# Altium project MT7688.PrjPcb (part 1 of 2)
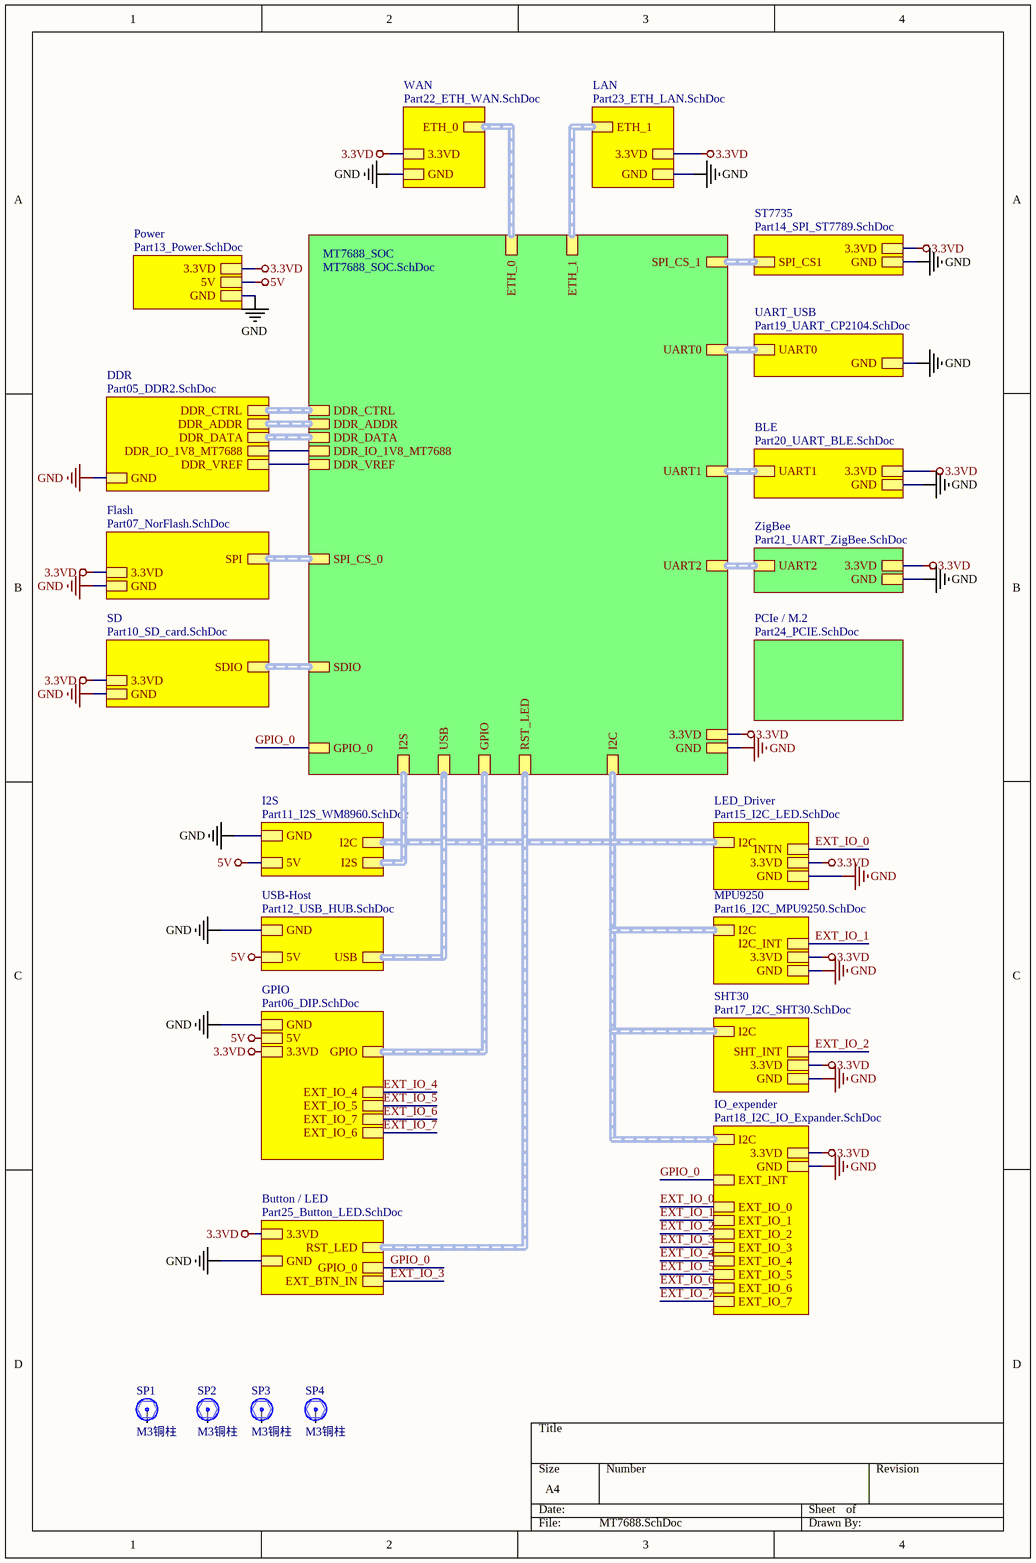
[diagram p0: MT7688.SchDoc]
26 sheets, 361 parts. Net scope: strictly hierarchical (ports join the sheet entries above them; power ports are local).
Board file: MT7688.PcbDoc
Sheets:
  MT7688.SchDoc
    MT7688_SOC = MT7688_SOC.SchDoc
      Designator = Part03_MT7688_Peripheral.SchDoc
      Designator = Part04_MT7688_Power.SchDoc
      Designator = Part01_MT7688_RF.SchDoc
      Designator = Part09_Config.SchDoc
      Designator = Part02_MT7688_DDR.SchDoc
    Power = Part13_Power.SchDoc
    DDR = Part05_DDR2.SchDoc
    WAN = Part22_ETH_WAN.SchDoc
    Flash = Part07_NorFlash.SchDoc
    Button / LED = Part25_Button_LED.SchDoc
    LAN = Part23_ETH_LAN.SchDoc
    GPIO = Part06_DIP.SchDoc
    I2S = Part11_I2S_WM8960.SchDoc
    ST7735 = Part14_SPI_ST7789.SchDoc
    BLE = Part20_UART_BLE.SchDoc
    SD = Part10_SD_card.SchDoc
    USB-Host = Part12_USB_HUB.SchDoc
    PCIe / M.2 = Part24_PCIE.SchDoc
    ZigBee = Part21_UART_ZigBee.SchDoc
    IO_expender = Part18_I2C_IO_Expander.SchDoc
    LED_Driver = Part15_I2C_LED.SchDoc
    MPU9250 = Part16_I2C_MPU9250.SchDoc
    SHT30 = Part17_I2C_SHT30.SchDoc
    UART_USB = Part19_UART_CP2104.SchDoc

## Sheet MT7688.SchDoc
size A4 portrait

### Parts
SP1  M3铜柱  [M3x5_N]
SP2  M3铜柱  [M3x5_N]
SP3  M3铜柱  [M3x5_N]
SP4  M3铜柱  [M3x5_N]

### Sub-sheets
BLE = Part20_UART_BLE.SchDoc: 3.3VD, UART1 (harness UART1), GND
Button / LED = Part25_Button_LED.SchDoc: GND, 3.3VD, RST_LED (harness RST), GPIO_0, EXT_BTN_IN
DDR = Part05_DDR2.SchDoc: DDR_CTRL (harness DDR_CTRL), DDR_ADDR (harness DDR_ADDR), DDR_DATA (harness DDR_DATA), DDR_IO_1V8_MT7688, DDR_VREF, GND
Flash = Part07_NorFlash.SchDoc: GND, SPI (harness SPI_CS_0), 3.3VD
GPIO = Part06_DIP.SchDoc: GPIO (harness GPIO), GND, 5V, 3.3VD, EXT_IO_4, EXT_IO_5, EXT_IO_7, EXT_IO_6
I2S = Part11_I2S_WM8960.SchDoc: 5V, I2S (harness I2S), GND, I2C (harness I2C)
IO_expender = Part18_I2C_IO_Expander.SchDoc: GND, 3.3VD, I2C (harness I2C), EXT_INT, EXT_IO_3, EXT_IO_6, EXT_IO_7, EXT_IO_5, EXT_IO_2, EXT_IO_0, EXT_IO_1, EXT_IO_4
LAN = Part23_ETH_LAN.SchDoc: GND, ETH_1 (harness ETH_1), 3.3VD
LED_Driver = Part15_I2C_LED.SchDoc: GND, I2C (harness I2C), 3.3VD, INTN
MPU9250 = Part16_I2C_MPU9250.SchDoc: I2C (harness I2C), 3.3VD, GND, I2C_INT
MT7688_SOC = MT7688_SOC.SchDoc: I2S, GPIO, UART0, DDR_IO_1V8_MT7688, GND, ETH_1, I2C, SPI_CS_1, SDIO, USB, DDR_CTRL, UART2, UART1, SPI_CS_0, ETH_0, DDR_DATA, DDR_ADDR, DDR_VREF, 3.3VD, GPIO_0, RST_LED
PCIe / M.2 = Part24_PCIE.SchDoc: no entries
Power = Part13_Power.SchDoc: GND, 3.3VD, 5V
SD = Part10_SD_card.SchDoc: 3.3VD, GND, SDIO (harness SDIO)
SHT30 = Part17_I2C_SHT30.SchDoc: 3.3VD, GND, I2C (harness I2C), SHT_INT
ST7735 = Part14_SPI_ST7789.SchDoc: 3.3VD, SPI_CS1 (harness SPI_CS_1), GND
UART_USB = Part19_UART_CP2104.SchDoc: UART0 (harness UART0), GND
USB-Host = Part12_USB_HUB.SchDoc: GND, 5V, USB (harness USB)
WAN = Part22_ETH_WAN.SchDoc: 3.3VD, GND, ETH_0 (harness ETH_0)
ZigBee = Part21_UART_ZigBee.SchDoc: UART2 (harness UART2), GND, 3.3VD

### Nets
3.3VD: sheet MT7688_SOC/3.3VD, sheet Power/3.3VD, sheet WAN/3.3VD, sheet Flash/3.3VD, sheet Button / LED/3.3VD, sheet LAN/3.3VD, sheet GPIO/3.3VD, sheet ST7735/3.3VD, sheet BLE/3.3VD, sheet SD/3.3VD, sheet ZigBee/3.3VD, sheet IO_expender/3.3VD, sheet LED_Driver/3.3VD, sheet MPU9250/3.3VD, sheet SHT30/3.3VD
5V: sheet Power/5V, sheet GPIO/5V, sheet I2S/5V, sheet USB-Host/5V
DDR_1V8: sheet MT7688_SOC/DDR_IO_1V8_MT7688, sheet DDR/DDR_IO_1V8_MT7688
DDR_VREF: sheet MT7688_SOC/DDR_VREF, sheet DDR/DDR_VREF
GND: sheet MT7688_SOC/GND, sheet Power/GND, sheet DDR/GND, sheet WAN/GND, sheet Flash/GND, sheet Button / LED/GND, sheet LAN/GND, sheet GPIO/GND, sheet I2S/GND, sheet ST7735/GND, sheet BLE/GND, sheet SD/GND, sheet USB-Host/GND, sheet ZigBee/GND, sheet IO_expender/GND, sheet LED_Driver/GND, sheet MPU9250/GND, sheet SHT30/GND, sheet UART_USB/GND
EXT_IO_0: sheet IO_expender/EXT_IO_0, sheet LED_Driver/INTN
EXT_IO_1: sheet IO_expender/EXT_IO_1, sheet MPU9250/I2C_INT
EXT_IO_2: sheet IO_expender/EXT_IO_2, sheet SHT30/SHT_INT
EXT_IO_3: sheet Button / LED/EXT_BTN_IN, sheet IO_expender/EXT_IO_3  [project net EXT_BTN_IN]
EXT_IO_4: sheet GPIO/EXT_IO_4, sheet IO_expender/EXT_IO_4  [project net EXT__4]
EXT_IO_5: sheet GPIO/EXT_IO_5, sheet IO_expender/EXT_IO_5  [project net EXT__5]
EXT_IO_6: sheet GPIO/EXT_IO_7, sheet IO_expender/EXT_IO_6  [project net EXT__7]
EXT_IO_7: sheet GPIO/EXT_IO_6, sheet IO_expender/EXT_IO_7  [project net EXT__6]
GPIO_0: sheet MT7688_SOC/GPIO_0, sheet Button / LED/GPIO_0, sheet IO_expender/EXT_INT  [project net EXT_INT]

Not connected (* = marked no-connect by the designer): SP1 1; SP2 1; SP3 1; SP4 1

### Buses and harness runs
harness sheet BLE/UART1 = sheet MT7688_SOC/UART1
harness sheet Button / LED/RST_LED = sheet MT7688_SOC/RST_LED
harness sheet DDR/DDR_ADDR = sheet MT7688_SOC/DDR_ADDR
harness sheet DDR/DDR_CTRL = sheet MT7688_SOC/DDR_CTRL
harness sheet DDR/DDR_DATA = sheet MT7688_SOC/DDR_DATA
harness sheet Flash/SPI = sheet MT7688_SOC/SPI_CS_0
harness sheet GPIO/GPIO = sheet MT7688_SOC/GPIO
harness sheet I2S/I2C = sheet IO_expender/I2C = sheet LED_Driver/I2C = sheet MPU9250/I2C = sheet MT7688_SOC/I2C = sheet SHT30/I2C
harness sheet I2S/I2S = sheet MT7688_SOC/I2S
harness sheet LAN/ETH_1 = sheet MT7688_SOC/ETH_1
harness sheet MT7688_SOC/ETH_0 = sheet WAN/ETH_0
harness sheet MT7688_SOC/SDIO = sheet SD/SDIO
harness sheet MT7688_SOC/SPI_CS_1 = sheet ST7735/SPI_CS1
harness sheet MT7688_SOC/UART0 = sheet UART_USB/UART0
harness sheet MT7688_SOC/UART2 = sheet ZigBee/UART2
harness sheet MT7688_SOC/USB = sheet USB-Host/USB

### Library data of the parts
SP1-SP4 = 铜柱大焊盘: 铜柱; 版权归属: 源创客; BOM名称: 铜柱; 学习资源: www.ooocke.com

## Sheet MT7688_SOC.SchDoc
size A4
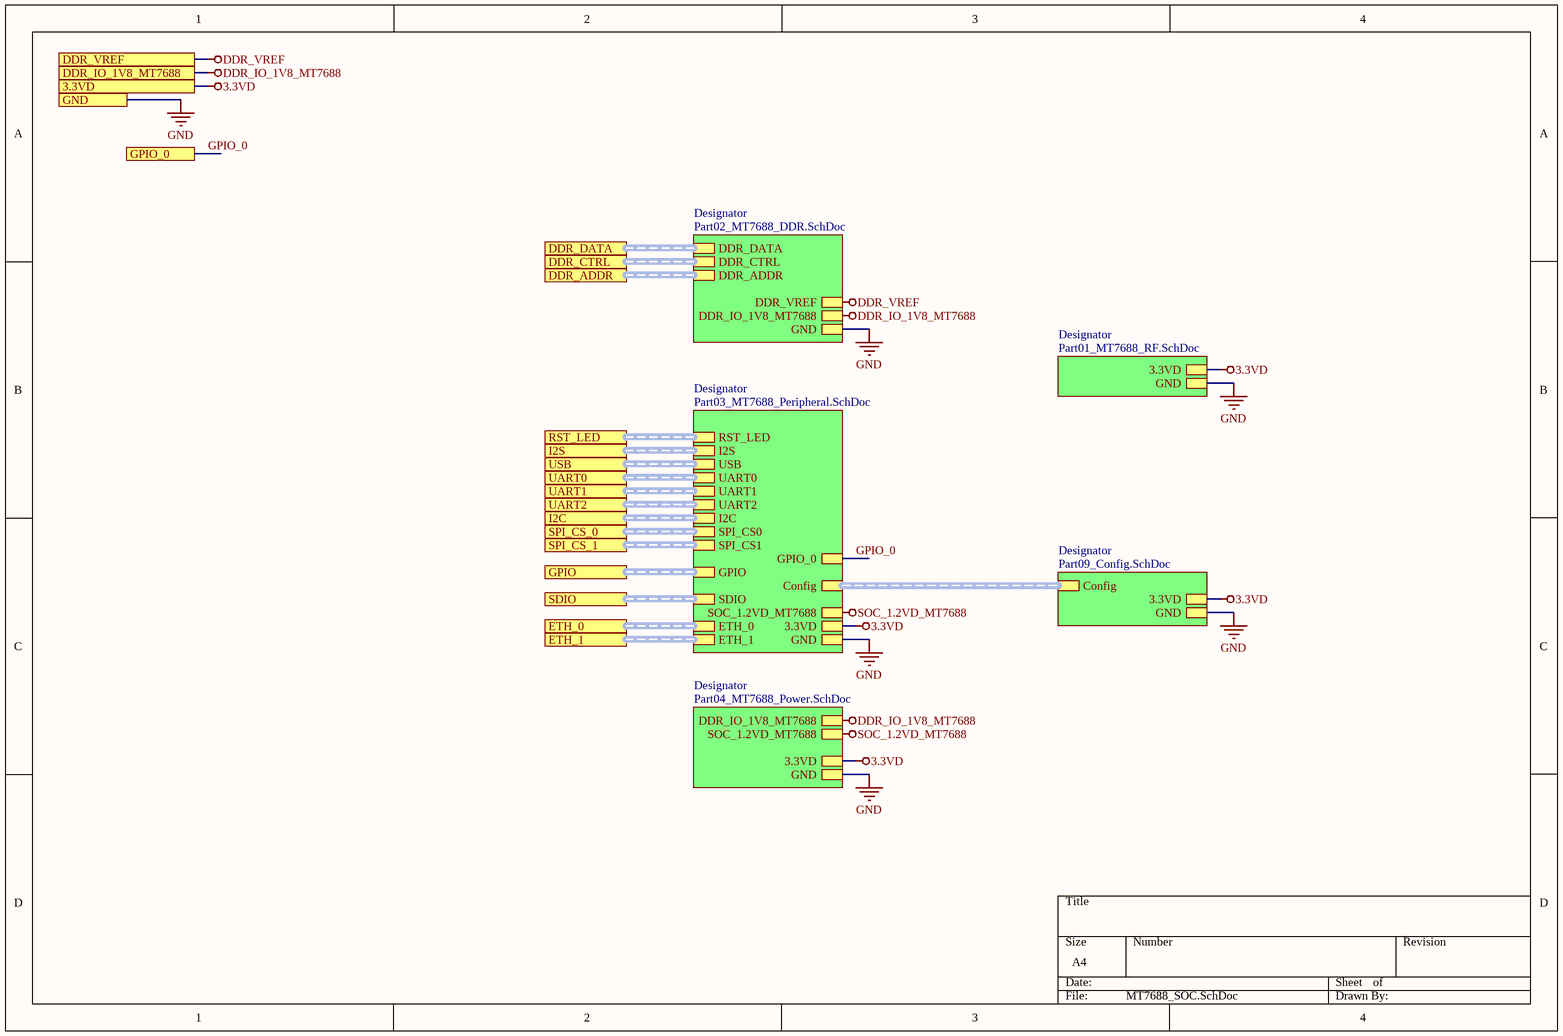
[diagram p1: MT7688_SOC.SchDoc]

### Sub-sheets
Designator = Part03_MT7688_Peripheral.SchDoc: I2S (harness I2S), USB (harness USB), UART1 (harness UART1), ETH_1 (harness ETH_1), UART0 (harness UART0), I2C (harness I2C), GPIO (harness GPIO), ETH_0 (harness ETH_0), UART2 (harness UART2), SDIO (harness SDIO), Config (harness Config), RST_LED (harness RST), SPI_CS0 (harness SPI_CS_0), SPI_CS1 (harness SPI_CS_1), 3.3VD, GND, SOC_1.2VD_MT7688, GPIO_0
Designator = Part04_MT7688_Power.SchDoc: GND, DDR_IO_1V8_MT7688, 3.3VD, SOC_1.2VD_MT7688
Designator = Part01_MT7688_RF.SchDoc: GND, 3.3VD
Designator = Part09_Config.SchDoc: GND, 3.3VD, Config (harness Config)
Designator = Part02_MT7688_DDR.SchDoc: DDR_DATA (harness DDR_DATA), DDR_CTRL (harness DDR_CTRL), DDR_ADDR (harness DDR_ADDR), DDR_VREF, DDR_IO_1V8_MT7688, GND

### Ports
3.3VD, DDR_ADDR, DDR_CTRL, DDR_DATA, DDR_IO_1V8_MT7688, DDR_VREF, ETH_0, ETH_1, GND, GPIO, GPIO_0, I2C, I2S, RST_LED, SDIO, SPI_CS_0, SPI_CS_1, UART0, UART1, UART2, USB

### Nets
3.3VD: port 3.3VD, sheet Designator/3.3VD, sheet Designator/3.3VD, sheet Designator/3.3VD, sheet Designator/3.3VD
DDR_IO_1V8_MT7688: port DDR_IO_1V8_MT7688, sheet Designator/DDR_IO_1V8_MT7688, sheet Designator/DDR_IO_1V8_MT7688  [project net DDR_1V8]
DDR_VREF: port DDR_VREF, sheet Designator/DDR_VREF
GND: port GND, sheet Designator/GND, sheet Designator/GND, sheet Designator/GND, sheet Designator/GND, sheet Designator/GND
SOC_1.2VD_MT7688: sheet Designator/SOC_1.2VD_MT7688, sheet Designator/SOC_1.2VD_MT7688
GPIO_0: port GPIO_0, sheet Designator/GPIO_0  [project net EXT_INT]

### Buses and harness runs
harness port DDR_ADDR = sheet Designator/DDR_ADDR
harness port DDR_CTRL = sheet Designator/DDR_CTRL
harness port DDR_DATA = sheet Designator/DDR_DATA
harness port ETH_0 = sheet Designator/ETH_0
harness port ETH_1 = sheet Designator/ETH_1
harness port GPIO = sheet Designator/GPIO
harness port I2C = sheet Designator/I2C
harness port I2S = sheet Designator/I2S
harness port RST_LED = sheet Designator/RST_LED
harness port SDIO = sheet Designator/SDIO
harness port SPI_CS_0 = sheet Designator/SPI_CS0
harness port SPI_CS_1 = sheet Designator/SPI_CS1
harness port UART0 = sheet Designator/UART0
harness port UART1 = sheet Designator/UART1
harness port UART2 = sheet Designator/UART2
harness port USB = sheet Designator/USB

## Sheet Part03_MT7688_Peripheral.SchDoc
size A4
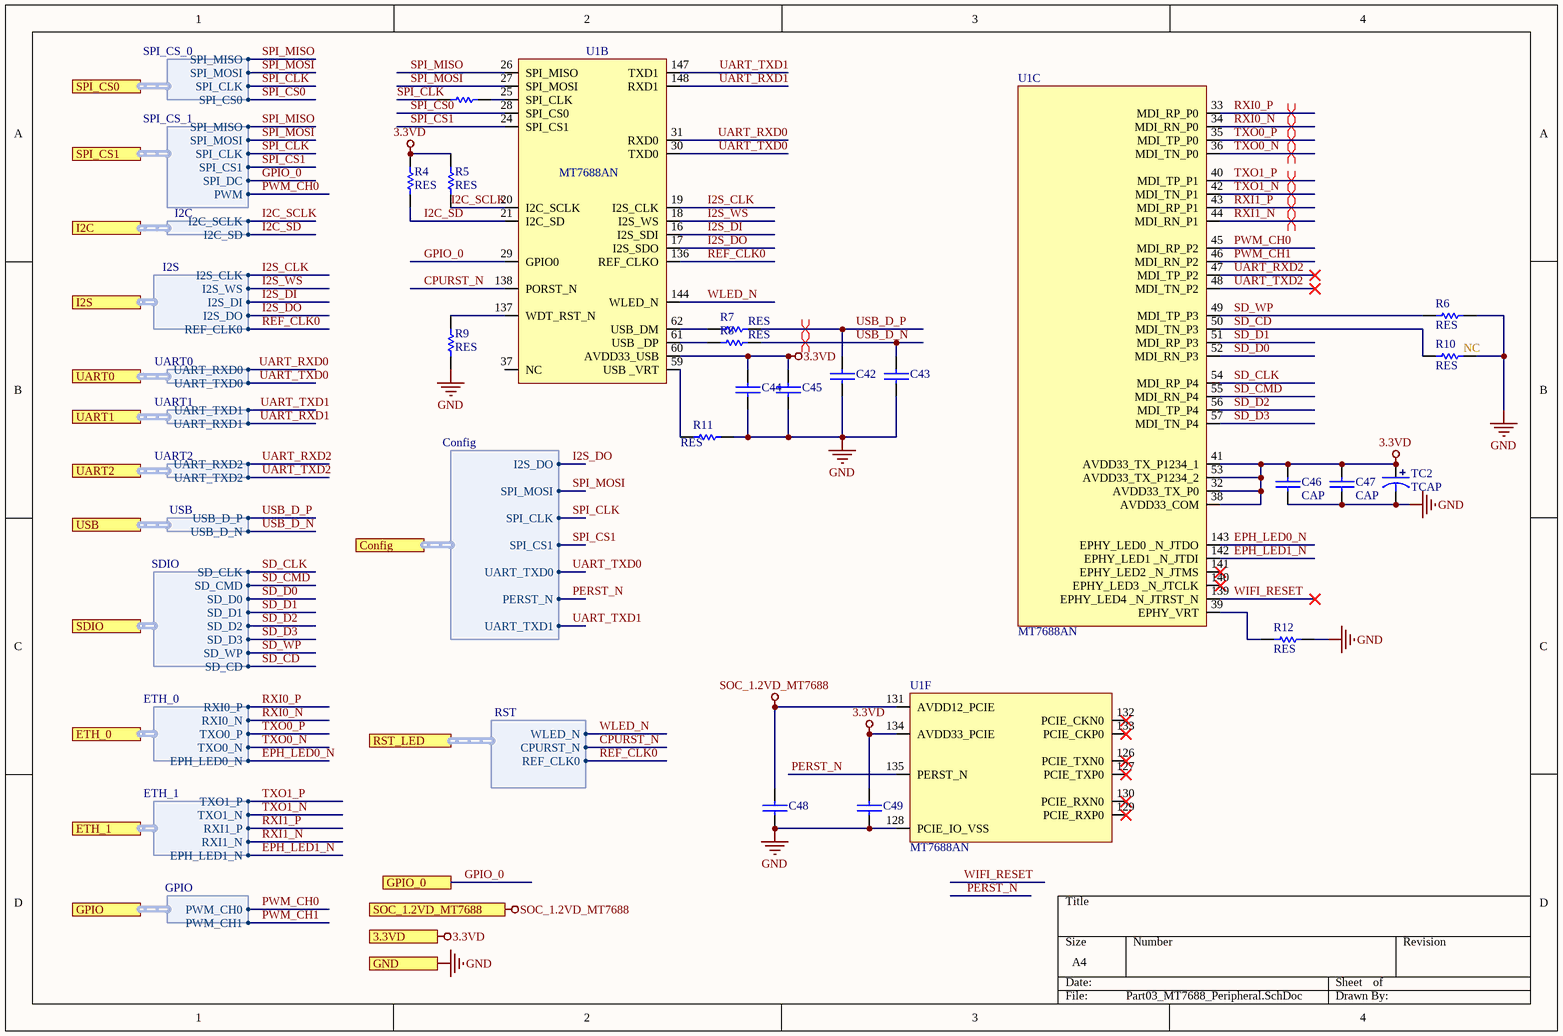
[diagram p2: Part03_MT7688_Peripheral.SchDoc]

### Parts
C42  CAP  [0402C]  (value not drawn)
C43  CAP  [0402C]  (value not drawn)
C44  CAP  [0402C]  (value not drawn)
C45  CAP  [0402C]  (value not drawn)
C46  CAP  [0402C]
C47  CAP  [0402C]
C48  CAP  [0402C]  (value not drawn)
C49  CAP  [0402C]  (value not drawn)
R3  RES  [0402R]  (value not drawn)
R4  RES  [0402R]
R5  RES  [0402R]
R6  RES  [0402R]
R7  RES  [0402R]
R8  RES  [0402R]
R9  RES  [0402R]
R10  RES  [0402R]
R11  RES  [0402R]
R12  RES  [0402R]
TC2  TCAP  [TAJ-A/3216]
U1  MT7688AN  [MT7628AN$2F$DRQFN156$2F$SMD$2F$P0.5$2F$12X12]  (parts B,C,F of 6)

### Ports
3.3VD, Config (harness Config), ETH_0 (harness ETH_0), ETH_1 (harness ETH_1), GND, GPIO (harness GPIO), GPIO_0, I2C (harness I2C), I2S (harness I2S), RST_LED (harness RST), SDIO (harness SDIO), SOC_1.2VD_MT7688, SPI_CS0 (harness SPI_CS_0), SPI_CS1 (harness SPI_CS_1), UART0 (harness UART0), UART1 (harness UART1), UART2 (harness UART2), USB (harness USB)

### Harnesses
SPI_CS_1: SPI_MISO, SPI_MOSI, SPI_CLK, SPI_CS1, SPI_DC, PWM
SPI_CS_0: SPI_MISO, SPI_MOSI, SPI_CLK, SPI_CS0
I2C: I2C_SCLK, I2C_SD
I2S: I2S_CLK, I2S_WS, I2S_DI, I2S_DO, REF_CLK0
UART0: UART_RXD0, UART_TXD0
UART1: UART_TXD1, UART_RXD1
UART2: UART_RXD2, UART_TXD2
USB: USB_D_P, USB_D_N
SDIO: SD_CLK, SD_CMD, SD_D0, SD_D1, SD_D2, SD_D3, SD_WP, SD_CD
ETH_0: RXI0_P, RXI0_N, TXO0_P, TXO0_N, EPH_LED0_N
ETH_1: TXO1_P, TXO1_N, RXI1_P, RXI1_N, EPH_LED1_N
GPIO: PWM_CH0, PWM_CH1
Config: I2S_DO, SPI_MOSI, SPI_CLK, SPI_CS1, UART_TXD0, PERST_N, UART_TXD1
RST: WLED_N, CPURST_N, REF_CLK0

### Nets
3.3VD: C44.1 C45.1 C46.1 C47.1 C49.1 R4.2 R5.2 TC2.1 U1.32(AVDD33_TX_P0) U1.38(AVDD33_COM) U1.41(AVDD33_TX_P1234_1) U1.53(AVDD33_TX_P1234_2) U1.60(AVDD33_USB) U1.134(AVDD33_PCIE) ; port 3.3VD
GND: C42.2 C43.2 C44.2 C45.2 C46.2 C47.2 C48.2 C49.2 R6.1 R9.1 R10.1 R11.1 R12.1 TC2.2 U1.128(PCIE_IO_VSS) ; port GND
SOC_1.2VD_MT7688: C48.1 U1.131(AVDD12_PCIE) ; port SOC_1.2VD_MT7688
CPURST_N: U1.138(PORST_N) ; port RST_LED.CPURST_N
EPH_LED0_N: U1.143(EPHY_LED0__N_JTDO) ; port ETH_0.EPH_LED0_N
EPH_LED1_N: U1.142(EPHY_LED1__N_JTDI) ; port ETH_1.EPH_LED1_N
GPIO_0: U1.29(GPIO0) ; port GPIO_0, port SPI_CS1.SPI_DC  [project net EXT_INT]
I2C_SCLK: R5.1 U1.20(I2C_SCLK) ; port I2C.I2C_SCLK
I2C_SD: R4.1 U1.21(I2C_SD) ; port I2C.I2C_SD
I2S_CLK: U1.19(I2S_CLK) ; port I2S.I2S_CLK
I2S_DI: U1.16(I2S_SDI) ; port I2S.I2S_DI
I2S_DO: U1.17(I2S_SDO) ; port I2S.I2S_DO, port Config.I2S_DO
I2S_WS: U1.18(I2S_WS) ; port I2S.I2S_WS
PERST_N: U1.135(PERST_N) ; port Config.PERST_N
PWM_CH0: U1.45(MDI_RP_P2) ; port SPI_CS1.PWM, port GPIO.PWM_CH0
PWM_CH1: U1.46(MDI_RN_P2) ; port GPIO.PWM_CH1
REF_CLK0: U1.136(REF_CLKO) ; port I2S.REF_CLK0, port RST_LED.REF_CLK0
RXI0_N: U1.34(MDI_RN_P0) ; port ETH_0.RXI0_N
RXI0_P: U1.33(MDI_RP_P0) ; port ETH_0.RXI0_P
RXI1_N: U1.44(MDI_RN_P1) ; port ETH_1.RXI1_N
RXI1_P: U1.43(MDI_RP_P1) ; port ETH_1.RXI1_P
SD_CD: R10.2 U1.50(MDI_TN_P3) ; port SDIO.SD_CD
SD_CLK: U1.54(MDI_RP_P4) ; port SDIO.SD_CLK
SD_CMD: U1.55(MDI_RN_P4) ; port SDIO.SD_CMD
SD_D0: U1.52(MDI_RN_P3) ; port SDIO.SD_D0
SD_D1: U1.51(MDI_RP_P3) ; port SDIO.SD_D1
SD_D2: U1.56(MDI_TP_P4) ; port SDIO.SD_D2
SD_D3: U1.57(MDI_TN_P4) ; port SDIO.SD_D3
SD_WP: R6.2 U1.49(MDI_TP_P3) ; port SDIO.SD_WP
SPI_CLK: R3.2 ; port SPI_CS1.SPI_CLK, port SPI_CS0.SPI_CLK, port Config.SPI_CLK  [project net CLK]
SPI_CS0: U1.28(SPI_CS0) ; port SPI_CS0.SPI_CS0  [project net CS0]
SPI_CS1: U1.24(SPI_CS1) ; port SPI_CS1.SPI_CS1, port Config.SPI_CS1
SPI_MISO: U1.26(SPI_MISO) ; port SPI_CS1.SPI_MISO, port SPI_CS0.SPI_MISO  [project net MISO]
SPI_MOSI: U1.27(SPI_MOSI) ; port SPI_CS1.SPI_MOSI, port SPI_CS0.SPI_MOSI, port Config.SPI_MOSI  [project net MOSI]
TXO0_N: U1.36(MDI_TN_P0) ; port ETH_0.TXO0_N
TXO0_P: U1.35(MDI_TP_P0) ; port ETH_0.TXO0_P
TXO1_N: U1.42(MDI_TN_P1) ; port ETH_1.TXO1_N
TXO1_P: U1.40(MDI_TP_P1) ; port ETH_1.TXO1_P
UART_RXD0: U1.31(RXD0) ; port UART0.UART_RXD0
UART_RXD1: U1.148(RXD1) ; port UART1.UART_RXD1
UART_RXD2: U1.47(MDI_TP_P2) ; port UART2.UART_RXD2
UART_TXD0: U1.30(TXD0) ; port UART0.UART_TXD0, port Config.UART_TXD0
UART_TXD1: U1.147(TXD1) ; port UART1.UART_TXD1, port Config.UART_TXD1
UART_TXD2: U1.48(MDI_TN_P2) ; port UART2.UART_TXD2
USB_D_N: C43.1 R8.1 ; port USB.USB_D_N
USB_D_P: C42.1 R7.1 ; port USB.USB_D_P
WIFI_RESET: U1.139(EPHY_LED4__N_JTRST_N)
WLED_N: U1.144(WLED_N) ; port RST_LED.WLED_N
NetR3_1: R3.1 U1.25(SPI_CLK)
NetR7_2: R7.2 U1.62(USB_DM)
NetR8_2: R8.2 U1.61(USB__DP)
NetR9_2: R9.2 U1.137(WDT_RST_N)
NetR11_2: R11.2 U1.59(USB__VRT)
NetR12_2: R12.2 U1.39(EPHY_VRT)

Not connected (* = marked no-connect by the designer): U1 37(NC) 126(PCIE_TXN0)* 127(PCIE_TXP0)* 129(PCIE_RXP0)* 130(PCIE_RXN0)* 132(PCIE_CKN0)* 133(PCIE_CKP0)* 140(EPHY_LED3__N_JTCLK)* 141(EPHY_LED2__N_JTMS)*

### Layout directives
differential pair: RXI0_N, RXI0_P, RXI1_N, RXI1_P, TXO0_N, TXO0_P, TXO1_N, TXO1_P, USB_D_N, USB_D_P

### Notes on the sheet
- (near R10) NC

### Library data of the parts
C42-C49 = CAP: 无极性电容
TC2 = TCAP: 钽电容

## Sheet Part04_MT7688_Power.SchDoc
size A4
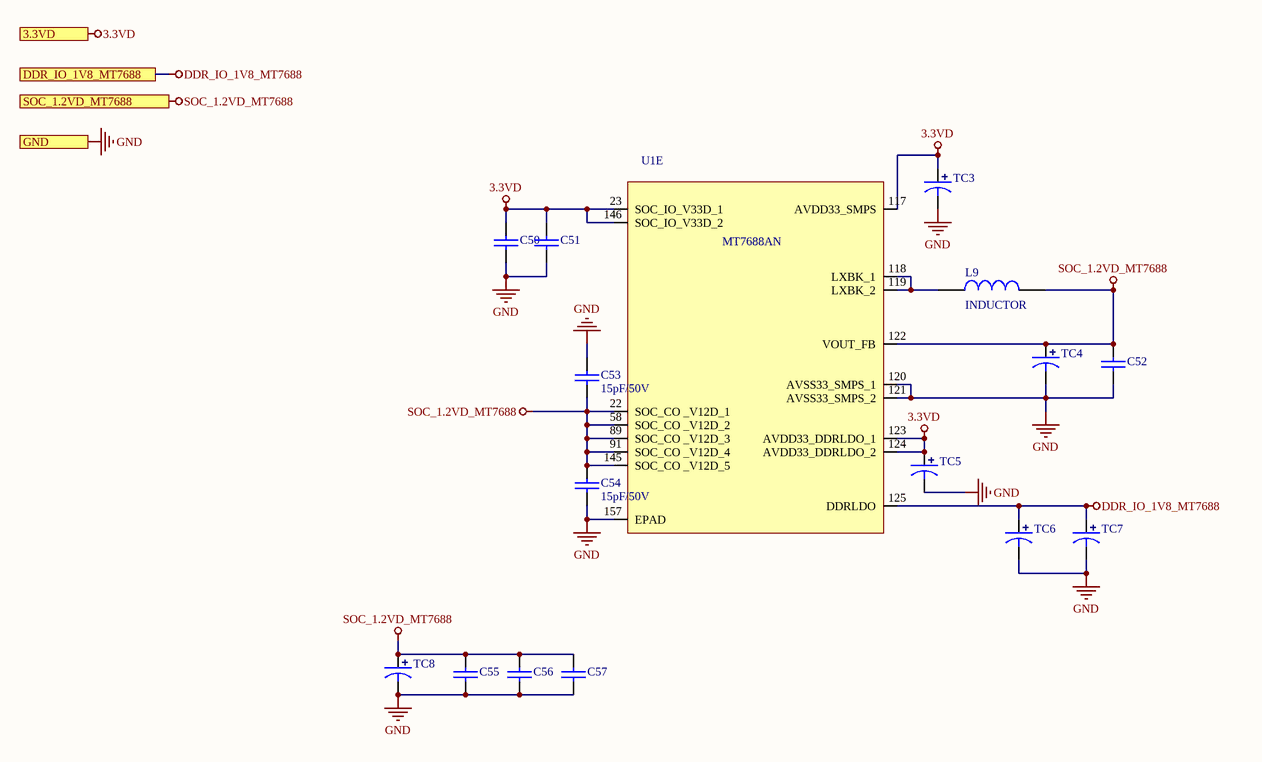
[diagram p3: Part04_MT7688_Power.SchDoc]

### Parts
C50  0.1uF/16V  [0402C]  (value not drawn)
C51  0.1uF/16V  [0402C]  (value not drawn)
C52  0.1uF/16V  [0402C]  (value not drawn)
C53  15pF/50V  [0402C]
C54  15pF/50V  [0402C]
C55  0.1uF/16V  [0402C]  (value not drawn)
C56  0.1uF/16V  [0402C]  (value not drawn)
C57  0.1uF/16V  [0402C]  (value not drawn)
L9  INDUCTOR  [CD31]
TC3  2.2uF/6.3V  [TAJ-A/3216]  (value not drawn)
TC4  10uF/6.3V  [TAJ-A/3216]  (value not drawn)
TC5  10uF/6.3V  [TAJ-A/3216]  (value not drawn)
TC6  2.2uF/6.3V  [TAJ-A/3216]  (value not drawn)
TC7  4.7uF/6.3V  [TAJ-A/3216]  (value not drawn)
TC8  4.7uF/6.3V  [TAJ-A/3216]  (value not drawn)
U1  MT7688AN  [MT7628AN$2F$DRQFN156$2F$SMD$2F$P0.5$2F$12X12]  (part E of 6)

### Ports
3.3VD, DDR_IO_1V8_MT7688, GND, SOC_1.2VD_MT7688

### Nets
3.3VD: C50.1 C51.1 TC3.1 TC5.1 U1.23(SOC_IO_V33D_1) U1.117(AVDD33_SMPS) U1.123(AVDD33_DDRLDO_1) U1.124(AVDD33_DDRLDO_2) U1.146(SOC_IO_V33D_2) ; port 3.3VD
DDR_IO_1V8_MT7688: TC6.1 TC7.1 U1.125(DDRLDO) ; port DDR_IO_1V8_MT7688  [project net DDR_1V8]
GND: C50.2 C51.2 C52.2 C53.1 C54.2 C55.2 C56.2 C57.2 TC3.2 TC4.2 TC5.2 TC6.2 TC7.2 TC8.2 U1.120(AVSS33_SMPS_1) U1.121(AVSS33_SMPS_2) U1.157(EPAD) ; port GND
SOC_1.2VD_MT7688: C52.1 C53.2 C54.1 C55.1 C56.1 C57.1 L9.2 TC4.1 TC8.1 U1.22(SOC_CO__V12D_1) U1.58(SOC_CO__V12D_2) U1.89(SOC_CO__V12D_3) U1.91(SOC_CO__V12D_4) U1.122(VOUT_FB) U1.145(SOC_CO__V12D_5) ; port SOC_1.2VD_MT7688
NetL9_1: L9.1 U1.118(LXBK_1) U1.119(LXBK_2)

### Library data of the parts
C50-C57 = CAP: 无极性电容
TC3-TC8 = TCAP: 钽电容

## Sheet Part01_MT7688_RF.SchDoc
size A4
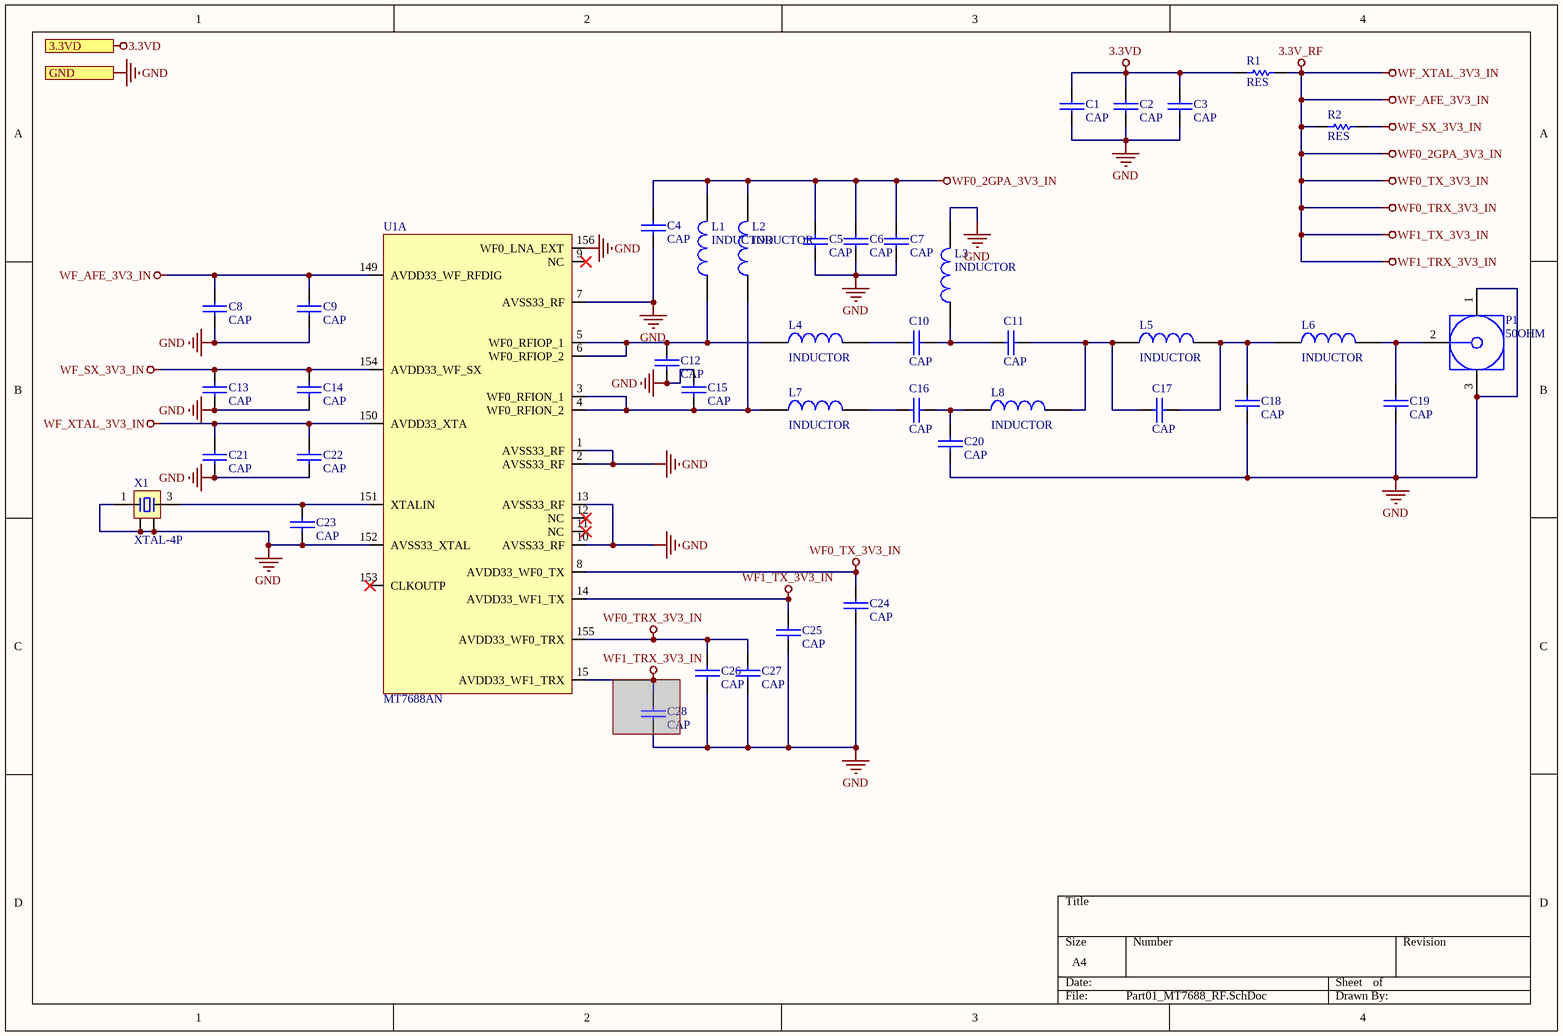
[diagram p4: Part01_MT7688_RF.SchDoc]

### Parts
C1  CAP  [0402C]
C2  CAP  [0402C]
C3  CAP  [0402C]
C4  CAP  [0402C]
C5  CAP  [0402C]
C6  CAP  [0402C]
C7  CAP  [0402C]
C8  CAP  [0402C]
C9  CAP  [0402C]
C10  CAP  [0402C]
C11  CAP  [0402C]
C12  CAP  [0402C]
C13  CAP  [0402C]
C14  CAP  [0402C]
C15  CAP  [0402C]
C16  CAP  [0402C]
C17  CAP  [0402C]
C18  CAP  [0402C]
C19  CAP  [0402C]
C20  CAP  [0402C]
C21  CAP  [0402C]
C22  CAP  [0402C]
C23  CAP  [0402C]
C24  CAP  [0402C]
C25  CAP  [0402C]
C26  CAP  [0402C]
C27  CAP  [0402C]
C28  CAP  [0402C]  (masked out: inside a compile mask, not in the netlist)
L1  INDUCTOR  [0402L]
L2  INDUCTOR  [0402L]
L3  INDUCTOR  [0402L]
L4  INDUCTOR  [0402L]
L5  INDUCTOR  [0402L]
L6  INDUCTOR  [0402L]
L7  INDUCTOR  [0402L]
L8  INDUCTOR  [0402L]
P1  50OHM  [IPEX]
R1  RES  [0603R]
R2  RES  [0402R]
U1  MT7688AN  [MT7628AN$2F$DRQFN156$2F$SMD$2F$P0.5$2F$12X12]  (part A of 6)
X1  XTAL-4P  [OSC 3225-4P]

### Ports
3.3VD, GND

### Nets
3.3V_RF: C4.1 C5.2 C6.2 C7.2 C8.2 C9.2 C21.2 C22.2 C24.1 C25.1 C26.1 C27.1 L1.2 L2.2 R1.2 R2.1 U1.8(AVDD33_WF0_TX) U1.14(AVDD33_WF1_TX) U1.149(AVDD33_WF_RFDIG) U1.150(AVDD33_XTA) U1.155(AVDD33_WF0_TRX)  [also labelled WF0_2GPA_3V3_IN, WF0_TRX_3V3_IN, WF0_TX_3V3_IN, WF1_TRX_3V3_IN, WF1_TX_3V3_IN, WF_AFE_3V3_IN, WF_XTAL_3V3_IN]
3.3VD: C1.2 C2.2 C3.2 R1.1 ; port 3.3VD
GND: C1.1 C2.1 C3.1 C4.2 C5.1 C6.1 C7.1 C8.1 C9.1 C12.1 C13.1 C14.1 C15.2 C18.2 C19.2 C20.2 C21.1 C22.1 C23.1 C24.2 C25.2 C26.2 C27.2 L3.2 P1.1 P1.3 U1.1(AVSS33_RF) U1.2(AVSS33_RF) U1.7(AVSS33_RF) U1.10(AVSS33_RF) U1.13(AVSS33_RF) U1.152(AVSS33_XTAL) U1.156(WF0_LNA_EXT) X1.1 X1.2 X1.4 ; port GND
WF_SX_3V3_IN: C13.2 C14.2 R2.2 U1.154(AVDD33_WF_SX)
NetC10_1: C10.1 C11.2 L3.1
NetC10_2: C10.2 L4.2
NetC11_1: C11.1 C17.2 L5.1 L8.2
NetC12_2: C12.2 L1.1 L4.1 U1.5(WF0_RFIOP_1) U1.6(WF0_RFIOP_2)
NetC15_1: C15.1 L2.1 L7.1 U1.3(WF0_RFION_1) U1.4(WF0_RFION_2)
NetC16_1: C16.1 C20.1 L8.1
NetC16_2: C16.2 L7.2
NetC17_1: C17.1 C18.1 L5.2 L6.1
NetC19_1: C19.1 L6.2 P1.2
NetC23_2: C23.2 U1.151(XTALIN) X1.3

Not connected (* = marked no-connect by the designer): U1 9(NC)* 11(NC)* 12(NC)* 15(AVDD33_WF1_TRX) 153(CLKOUTP)*

### Library data of the parts
C1-C28 = CAP: 无极性电容
P1 = IPEX: RF Coaxial PCB Connector, MCX; Thru-Hole, Right-Angle Mount Socket, Blunt Post Terminal, 50 Ohm Impedance; PCB_Layout: Complies with manufacturer's recommendation.; DrillSize: Corresponds to nominal value.; Published: 15-Jul-2004; LatestRevisionDate: 15-Jul-2004; LatestRevisionNote: Component Replaced.; DatasheetDocument: 30-May-2003; PackageDocument: 04-Jul-1999; PackageReference: 919-119J-51AX; Publisher: Altium Limited; ComponentLink1Description: Manufacturer Link; ComponentLink1URL: http://www.amphenolrf.com/
X1 = XTAL-4P: 4脚无源晶振

## Sheet Part09_Config.SchDoc
size A4
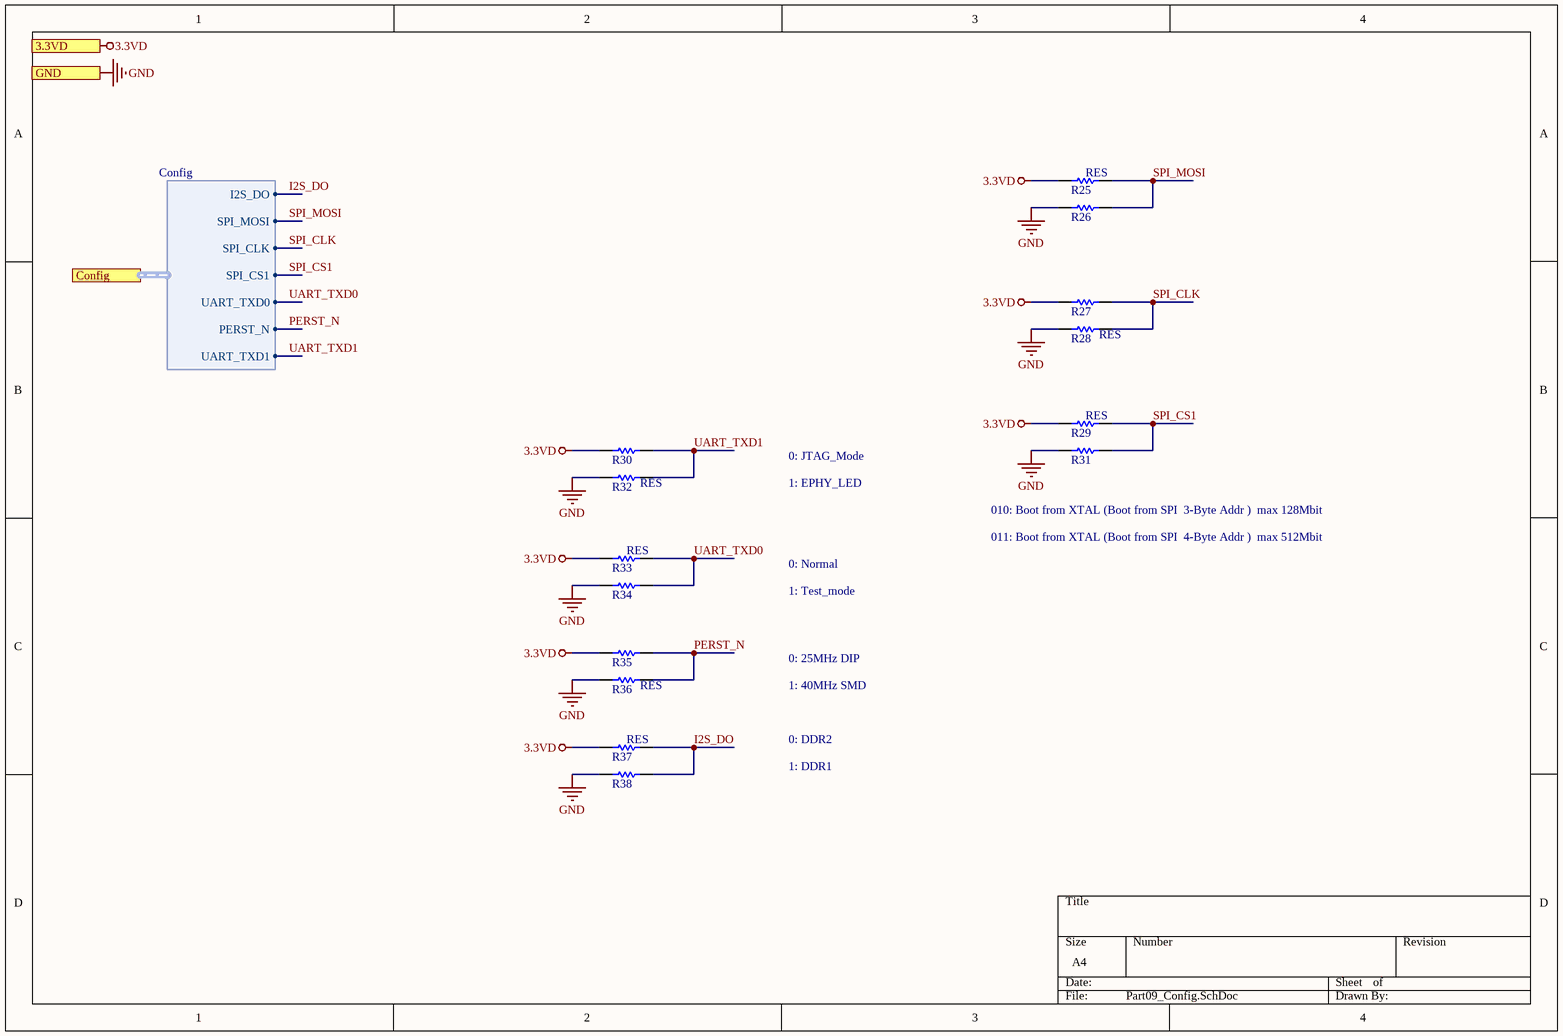
[diagram p5: Part09_Config.SchDoc]

### Parts
R25  RES  [0402R]
R26  RES  [0402R]  (value not drawn)
R27  RES  [0402R]  (value not drawn)
R28  RES  [0402R]
R29  RES  [0402R]
R30  RES  [0402R]  (value not drawn)
R31  RES  [0402R]  (value not drawn)
R32  RES  [0402R]
R33  RES  [0402R]
R34  RES  [0402R]  (value not drawn)
R35  RES  [0402R]  (value not drawn)
R36  RES  [0402R]
R37  RES  [0402R]
R38  RES  [0402R]  (value not drawn)

### Ports
3.3VD, Config (harness Config), GND

### Harnesses
Config: I2S_DO, SPI_MOSI, SPI_CLK, SPI_CS1, UART_TXD0, PERST_N, UART_TXD1

### Nets
3.3VD: R25.1 R27.1 R29.1 R30.1 R33.1 R35.1 R37.1 ; port 3.3VD
GND: R26.1 R28.1 R31.1 R32.1 R34.1 R36.1 R38.1 ; port GND
I2S_DO: R37.2 R38.2 ; port Config.I2S_DO
PERST_N: R35.2 R36.2 ; port Config.PERST_N
SPI_CLK: R27.2 R28.2 ; port Config.SPI_CLK  [project net CLK]
SPI_CS1: R29.2 R31.2 ; port Config.SPI_CS1
SPI_MOSI: R25.2 R26.2 ; port Config.SPI_MOSI  [project net MOSI]
UART_TXD0: R33.2 R34.2 ; port Config.UART_TXD0
UART_TXD1: R30.2 R32.2 ; port Config.UART_TXD1

### Notes on the sheet
- 0: JTAG_Mode
- 1: EPHY_LED
- 010: Boot from XTAL (Boot from SPI  3-Byte Addr )  max 128Mbit
- 0: Normal
- 011: Boot from XTAL (Boot from SPI  4-Byte Addr )  max 512Mbit
- 1: Test_mode
- 0: 25MHz DIP
- 1: 40MHz SMD
- 0: DDR2
- 1: DDR1

## Sheet Part02_MT7688_DDR.SchDoc
size A4
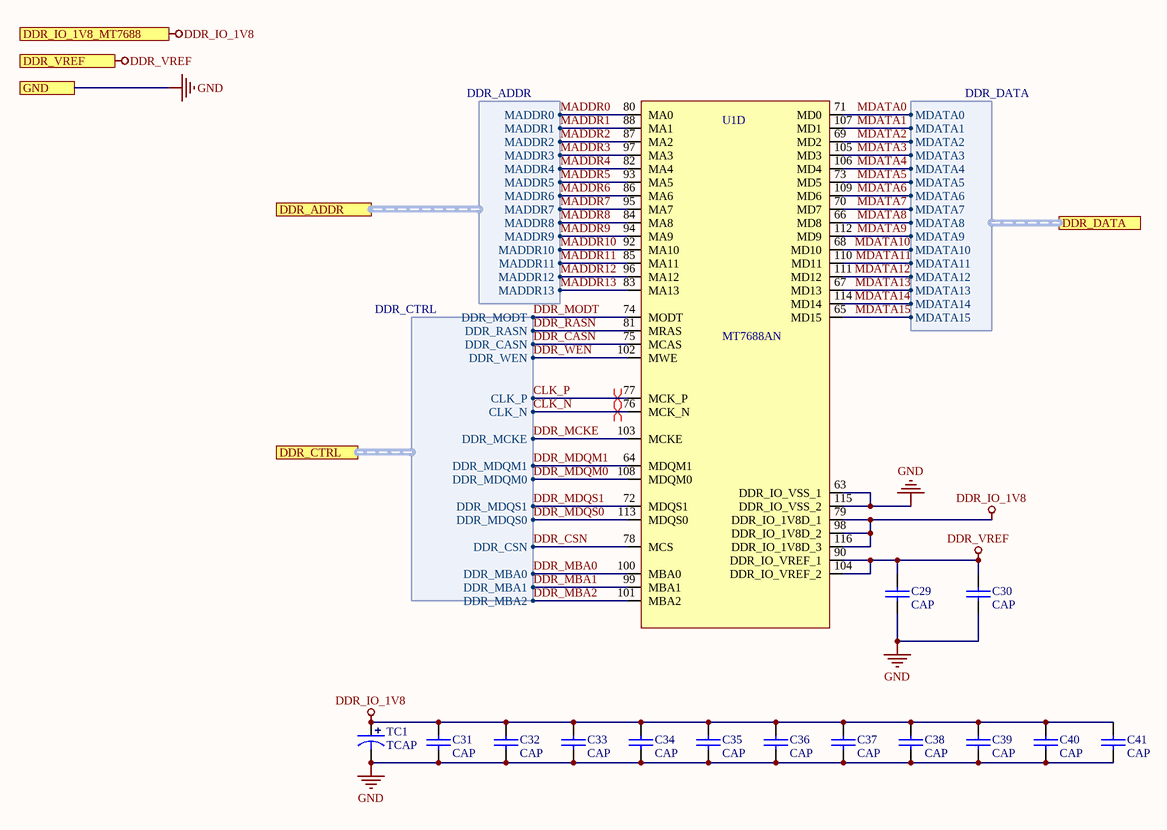
[diagram p6: Part02_MT7688_DDR.SchDoc]

### Parts
C29  CAP  [0402C]
C30  CAP  [0402C]
C31  CAP  [0402C]
C32  CAP  [0402C]
C33  CAP  [0402C]
C34  CAP  [0402C]
C35  CAP  [0402C]
C36  CAP  [0402C]
C37  CAP  [0402C]
C38  CAP  [0402C]
C39  CAP  [0402C]
C40  CAP  [0402C]
C41  CAP  [0402C]
TC1  TCAP  [TAJ-A/3216]
U1  MT7688AN  [MT7628AN$2F$DRQFN156$2F$SMD$2F$P0.5$2F$12X12]  (part D of 6)

### Ports
DDR_ADDR (harness DDR_ADDR), DDR_CTRL (harness DDR_CTRL), DDR_DATA (harness DDR_DATA), DDR_IO_1V8_MT7688, DDR_VREF, GND

### Harnesses
DDR_ADDR: MADDR0, MADDR1, MADDR2, MADDR3, MADDR4, MADDR5, MADDR6, MADDR7, MADDR8, MADDR9, MADDR10, MADDR11, MADDR12, MADDR13
DDR_DATA: MDATA0, MDATA1, MDATA2, MDATA3, MDATA4, MDATA5, MDATA6, MDATA7, MDATA8, MDATA9, MDATA10, MDATA11, MDATA12, MDATA13, MDATA14, MDATA15
DDR_CTRL: DDR_MODT, DDR_RASN, DDR_CASN, DDR_WEN, CLK_P, CLK_N, DDR_MCKE, DDR_MDQM1, DDR_MDQM0, DDR_MDQS1, DDR_MDQS0, DDR_CSN, DDR_MBA0, DDR_MBA1, DDR_MBA2

### Nets
DDR_IO_1V8: C31.1 C32.1 C33.1 C34.1 C35.1 C36.1 C37.1 C38.1 C39.1 C40.1 C41.1 TC1.1 U1.79(DDR_IO_1V8D_1) U1.98(DDR_IO_1V8D_2) U1.116(DDR_IO_1V8D_3) ; port DDR_IO_1V8_MT7688  [project net DDR_1V8]
DDR_VREF: C29.1 C30.1 U1.90(DDR_IO_VREF_1) U1.104(DDR_IO_VREF_2) ; port DDR_VREF
GND: C29.2 C30.2 C31.2 C32.2 C33.2 C34.2 C35.2 C36.2 C37.2 C38.2 C39.2 C40.2 C41.2 TC1.2 U1.63(DDR_IO_VSS_1) U1.115(DDR_IO_VSS_2) ; port GND
CLK_N: U1.76(MCK_N) ; port DDR_CTRL.CLK_N
CLK_P: U1.77(MCK_P) ; port DDR_CTRL.CLK_P
DDR_CASN: U1.75(MCAS) ; port DDR_CTRL.DDR_CASN
DDR_CSN: U1.78(MCS) ; port DDR_CTRL.DDR_CSN
DDR_MBA0: U1.100(MBA0) ; port DDR_CTRL.DDR_MBA0
DDR_MBA1: U1.99(MBA1) ; port DDR_CTRL.DDR_MBA1
DDR_MBA2: U1.101(MBA2) ; port DDR_CTRL.DDR_MBA2
DDR_MCKE: U1.103(MCKE) ; port DDR_CTRL.DDR_MCKE
DDR_MDQM0: U1.108(MDQM0) ; port DDR_CTRL.DDR_MDQM0
DDR_MDQM1: U1.64(MDQM1) ; port DDR_CTRL.DDR_MDQM1
DDR_MDQS0: U1.113(MDQS0) ; port DDR_CTRL.DDR_MDQS0
DDR_MDQS1: U1.72(MDQS1) ; port DDR_CTRL.DDR_MDQS1
DDR_MODT: U1.74(MODT) ; port DDR_CTRL.DDR_MODT
DDR_RASN: U1.81(MRAS) ; port DDR_CTRL.DDR_RASN
DDR_WEN: U1.102(MWE) ; port DDR_CTRL.DDR_WEN
MADDR0: U1.80(MA0) ; port DDR_ADDR.MADDR0
MADDR1: U1.88(MA1) ; port DDR_ADDR.MADDR1
MADDR2: U1.87(MA2) ; port DDR_ADDR.MADDR2
MADDR3: U1.97(MA3) ; port DDR_ADDR.MADDR3
MADDR4: U1.82(MA4) ; port DDR_ADDR.MADDR4
MADDR5: U1.93(MA5) ; port DDR_ADDR.MADDR5
MADDR6: U1.86(MA6) ; port DDR_ADDR.MADDR6
MADDR7: U1.95(MA7) ; port DDR_ADDR.MADDR7
MADDR8: U1.84(MA8) ; port DDR_ADDR.MADDR8
MADDR9: U1.94(MA9) ; port DDR_ADDR.MADDR9
MADDR10: U1.92(MA10) ; port DDR_ADDR.MADDR10
MADDR11: U1.85(MA11) ; port DDR_ADDR.MADDR11
MADDR12: U1.96(MA12) ; port DDR_ADDR.MADDR12
MADDR13: U1.83(MA13) ; port DDR_ADDR.MADDR13
MDATA0: U1.71(MD0) ; port DDR_DATA.MDATA0
MDATA1: U1.107(MD1) ; port DDR_DATA.MDATA1
MDATA2: U1.69(MD2) ; port DDR_DATA.MDATA2
MDATA3: U1.105(MD3) ; port DDR_DATA.MDATA3
MDATA4: U1.106(MD4) ; port DDR_DATA.MDATA4
MDATA5: U1.73(MD5) ; port DDR_DATA.MDATA5
MDATA6: U1.109(MD6) ; port DDR_DATA.MDATA6
MDATA7: U1.70(MD7) ; port DDR_DATA.MDATA7
MDATA8: U1.66(MD8) ; port DDR_DATA.MDATA8
MDATA9: U1.112(MD9) ; port DDR_DATA.MDATA9
MDATA10: U1.68(MD10) ; port DDR_DATA.MDATA10
MDATA11: U1.110(MD11) ; port DDR_DATA.MDATA11
MDATA12: U1.111(MD12) ; port DDR_DATA.MDATA12
MDATA13: U1.67(MD13) ; port DDR_DATA.MDATA13
MDATA14: U1.114(MD14) ; port DDR_DATA.MDATA14
MDATA15: U1.65(MD15) ; port DDR_DATA.MDATA15

### Layout directives
differential pair: CLK_N, CLK_P

### Library data of the parts
C29-C41 = CAP: 无极性电容
TC1 = TCAP: 钽电容

## Sheet Part13_Power.SchDoc
size A4
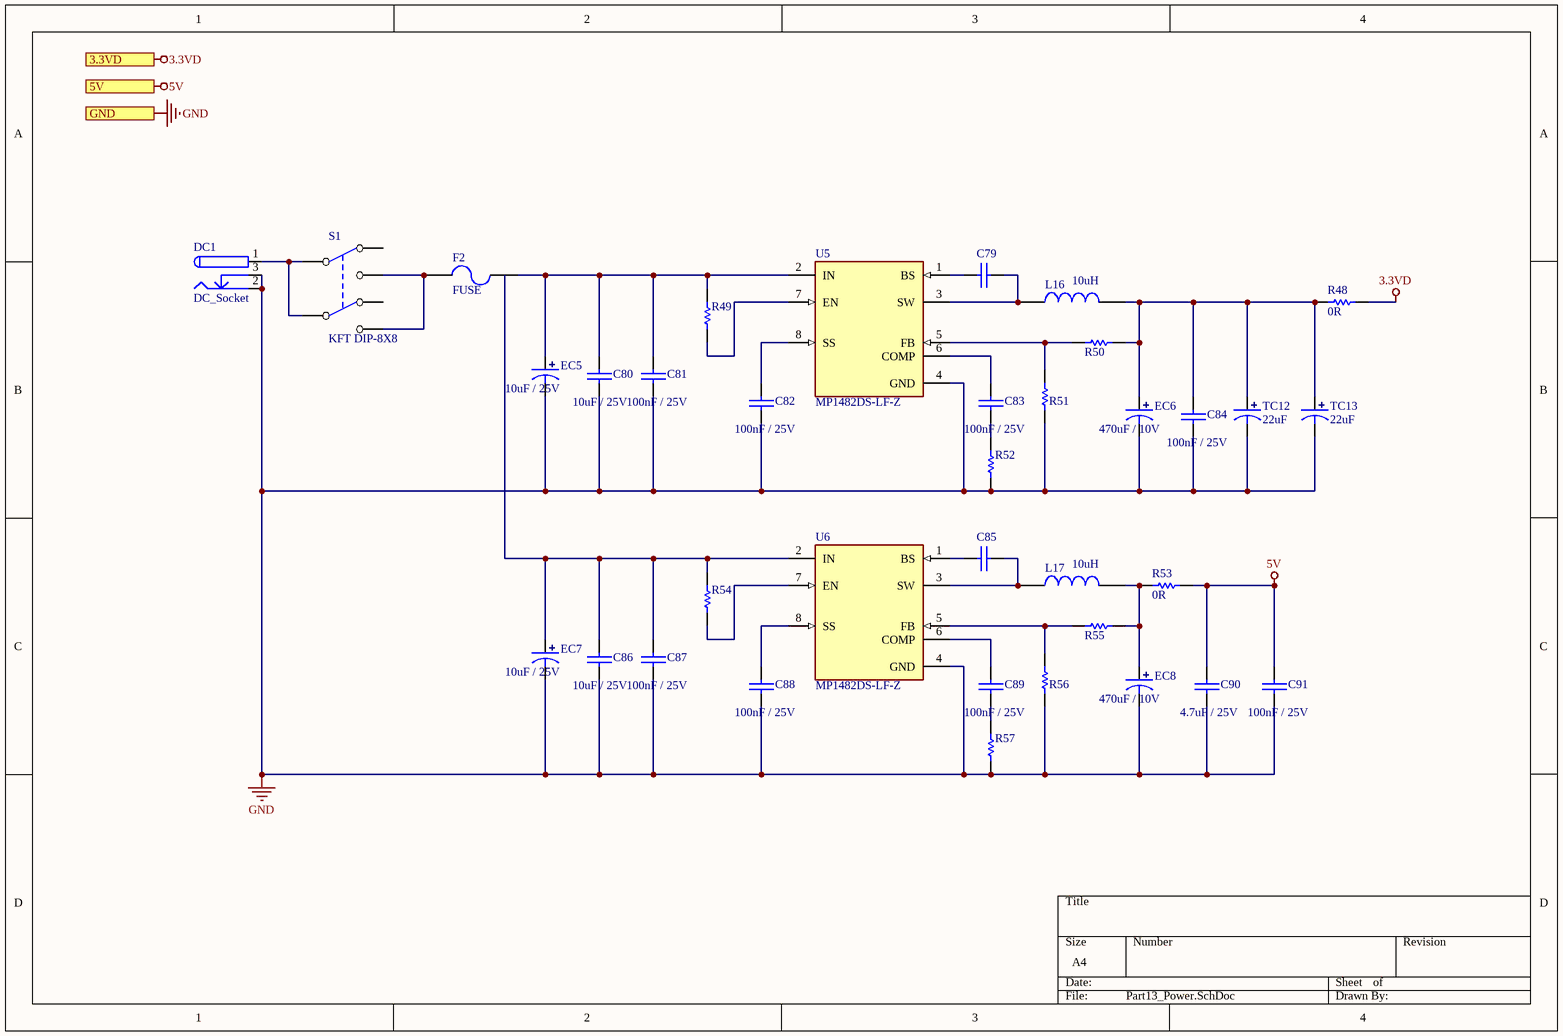
[diagram p7: Part13_Power.SchDoc]

### Parts
C79  10nF / 25V  [0603C]  (value not drawn)
C80  10uF / 25V  [0603C]
C81  100nF / 25V  [0603C]
C82  100nF / 25V  [0603C]
C83  100nF / 25V  [0603C]
C84  100nF / 25V  [0603C]
C85  10nF / 25V  [0603C]  (value not drawn)
C86  10uF / 25V  [0603C]
C87  100nF / 25V  [0603C]
C88  100nF / 25V  [0603C]
C89  100nF / 25V  [0603C]
C90  4.7uF / 25V  [0603C]
C91  100nF / 25V  [0603C]
DC1  DC_Socket  [DC-005]
EC5  10uF / 25V  [SMD-EC4.0X4.3X5.4]
EC6  470uF / 10V  [SMD-EC6.3X6.3X10]
EC7  10uF / 25V  [SMD-EC4.0X4.3X5.4]
EC8  470uF / 10V  [SMD-EC6.3X6.3X10]
F2  FUSE  [FUSE-1210]
L16  10uH  [CD42]
L17  10uH  [CD42]
R48  0R  [0603R]
R49  30K  [0402R]  (value not drawn)
R50  26.1k / 1%  [0402R]  (value not drawn)
R51  10K / 1%  [0402R]  (value not drawn)
R52  5.6k  [0402R]  (value not drawn)
R53  0R  [0603R]
R54  30K  [0402R]  (value not drawn)
R55  26.1k / 1%  [0402R]  (value not drawn)
R56  10K / 1%  [0402R]  (value not drawn)
R57  5.6k  [0402R]  (value not drawn)
S1  KFT DIP-8X8  [KFT DIP-8X8]
TC12  22uF  [TAJ-A/3216]
TC13  22uF  [TAJ-A/3216]
U5  MP1482DS-LF-Z  [FP-MP1482DS-LF-Z-MFG]
U6  MP1482DS-LF-Z  [FP-MP1482DS-LF-Z-MFG]

### Ports
3.3VD, 5V, GND

### Nets
3.3VD: R48.2 ; port 3.3VD
5V: C90.2 C91.2 R53.2 ; port 5V
GND: C80.1 C81.1 C82.1 C84.1 C86.1 C87.1 C88.1 C90.1 C91.1 DC1.2 DC1.3 EC5.2 EC6.2 EC7.2 EC8.2 R51.1 R52.2 R56.1 R57.2 TC12.2 TC13.2 U5.4(GND) U6.4(GND) ; port GND
NetC79_1: C79.1 L16.1 U5.3(SW)
NetC79_2: C79.2 U5.1(BS)
NetC80_2: C80.2 C81.2 EC5.1 F2.2 R49.1 U5.2(IN)
NetC82_2: C82.2 U5.8(SS)
NetC83_1: C83.1 R52.1
NetC83_2: C83.2 U5.6(COMP)
NetC84_2: C84.2 EC6.1 L16.2 R48.1 R50.2 TC12.1 TC13.1
NetC85_1: C85.1 L17.1 U6.3(SW)
NetC85_2: C85.2 U6.1(BS)
NetC86_2: C86.2 C87.2 EC7.1 R54.1 U6.2(IN)
NetC88_2: C88.2 U6.8(SS)
NetC89_1: C89.1 R57.1
NetC89_2: C89.2 U6.6(COMP)
NetDC1_1: DC1.1 S1.2 S1.5
NetEC8_1: EC8.1 L17.2 R53.1 R55.2
NetF2_1: F2.1 S1.1 S1.6
NetR49_2: R49.2 U5.7(EN)
NetR50_1: R50.1 R51.2 U5.5(FB)
NetR54_2: R54.2 U6.7(EN)
NetR55_1: R55.1 R56.2 U6.5(FB)

Not connected (* = marked no-connect by the designer): S1 3 4

### Library data of the parts
C79-C91 = CAP: 无极性电容
EC5-EC8 = SMD_ECAP: 贴片电解电容
L16 L17 = INDUCTOR
R48-R57 = RES
TC12 TC13 = TCAP: 钽电容
U5 U6 = CMP-57379-000001-1: IC REG BUCK ADJUSTABLE 2A 8SOIC; Manufacturer: Monolithic Power Systems; Max Duty Cycle: 90%; Switching Frequency: 340kHz; Standoff Height: 0.1mm; Max Power Dissipation: 1.38W; Output Type: AdjustableProgrammable; Output Voltage: 0.923-15V; Nominal Supply Current: 1.3mA; Max Supply Voltage: 18V; Max Junction Temp: +125°C; Number Of Outputs: 1; Min Supply Voltage: 4.75V; Switching Topology: Buck; Ambient Temperature Range High: +85°C; Temperature: -40°C to +125°C; Device Class L2: Power Management ICs; Mouser Description: MP1482 Series 18 V 2 A SMT Synchronous Rectified Step-Down Converter-SOIC-8; Device Class L3: Voltage Regulators - Switching; Ipc Land Pattern Name: SOIC127P600X155-8; Automotive: No; Octopart: https://octopart.com/mp1482ds-lf-z-monolithic+power+systems-17392490; ComponentLink2Description: Datasheet; RoHS: TRUE; Height: 1.75mm; Digikey Description: IC REG BUCK ADJUSTABLE 2A 8SOIC; Lead Free: Yes; Device Class L1: Integrated Circuits (ICs); Temperature Range Low: -40°C; Category: IC; Manufacturer Part Number: MP1482DS-LF-Z; Package: 0; Output Current: 2A; ComponentLink2URL: https://www.monolithicpower.com/en/documentview/productdocument/index/version/2/document_type/Datasheet/lang/en/sku/MP1482/document_id/344/; Temperature Range High: +125°C; Ambient Temperature Range Low: -40°C

## Sheet Part05_DDR2.SchDoc
size A4
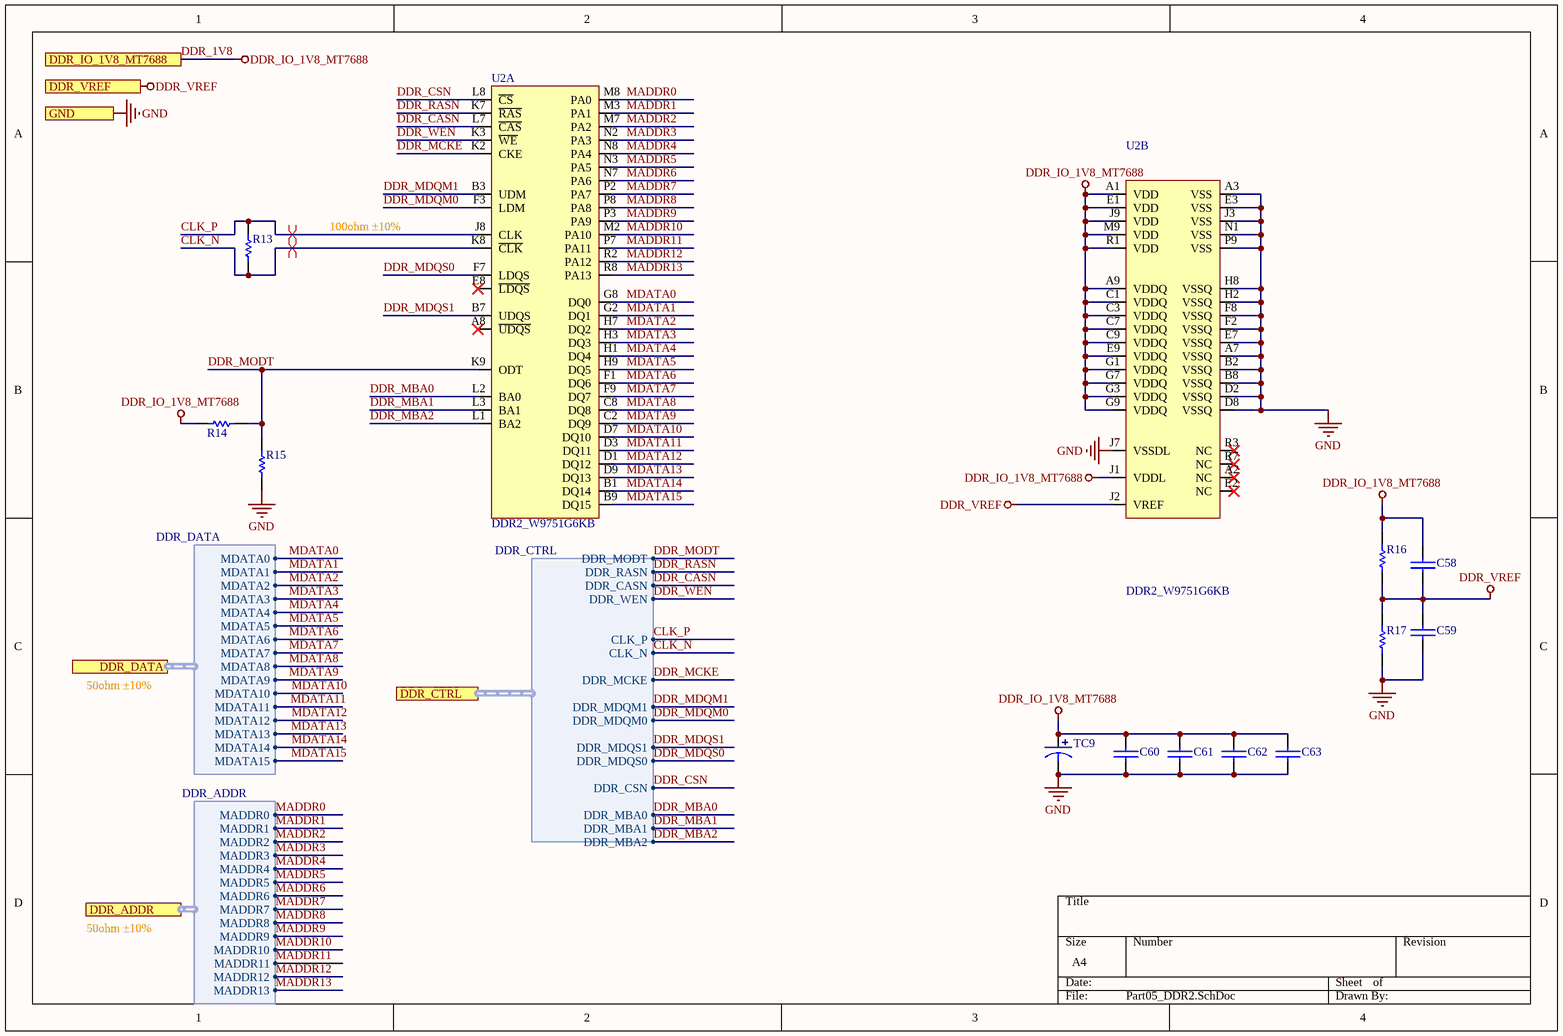
[diagram p8: Part05_DDR2.SchDoc]

### Parts
C58  0.1uF/16V  [0402C]  (value not drawn)
C59  0.1uF/16V  [0402C]  (value not drawn)
C60  0.1uF/16V  [0402C]  (value not drawn)
C61  0.1uF/16V  [0402C]  (value not drawn)
C62  0.1uF/16V  [0402C]  (value not drawn)
C63  0.1uF/16V  [0402C]  (value not drawn)
R13  RES  [0402R]  (value not drawn)
R14  RES  [0402R]  (value not drawn)
R15  RES  [0402R]  (value not drawn)
R16  RES  [0402R]  (value not drawn)
R17  RES  [0402R]  (value not drawn)
TC9  4.7uF/6.3V  [TAJ-A/3216]  (value not drawn)
U2  DDR2_W9751G6KB  [MICT-RT-84]  (parts A,B of 2)

### Ports
DDR_ADDR (harness DDR_ADDR), DDR_CTRL (harness DDR_CTRL), DDR_DATA (harness DDR_DATA), DDR_IO_1V8_MT7688, DDR_VREF, GND

### Harnesses
DDR_DATA: MDATA0, MDATA1, MDATA2, MDATA3, MDATA4, MDATA5, MDATA6, MDATA7, MDATA8, MDATA9, MDATA10, MDATA11, MDATA12, MDATA13, MDATA14, MDATA15
DDR_ADDR: MADDR0, MADDR1, MADDR2, MADDR3, MADDR4, MADDR5, MADDR6, MADDR7, MADDR8, MADDR9, MADDR10, MADDR11, MADDR12, MADDR13
DDR_CTRL: DDR_MODT, DDR_RASN, DDR_CASN, DDR_WEN, CLK_P, CLK_N, DDR_MCKE, DDR_MDQM1, DDR_MDQM0, DDR_MDQS1, DDR_MDQS0, DDR_CSN, DDR_MBA0, DDR_MBA1, DDR_MBA2

### Nets
DDR_1V8: C58.1 C60.1 C61.1 C62.1 C63.1 R14.1 R16.1 TC9.1 U2.A1(VDD) U2.A9(VDDQ) U2.C1(VDDQ) U2.C3(VDDQ) U2.C7(VDDQ) U2.C9(VDDQ) U2.E1(VDD) U2.E9(VDDQ) U2.G1(VDDQ) U2.G3(VDDQ) U2.G7(VDDQ) U2.G9(VDDQ) U2.J1(VDDL) U2.J9(VDD) U2.M9(VDD) U2.R1(VDD) ; port DDR_IO_1V8_MT7688  [also labelled DDR_IO_1V8_MT7688]
DDR_VREF: C58.2 C59.1 R16.2 R17.1 U2.J2(VREF) ; port DDR_VREF
GND: C59.2 C60.2 C61.2 C62.2 C63.2 R15.2 R17.2 TC9.2 U2.A3(VSS) U2.A7(VSSQ) U2.B2(VSSQ) U2.B8(VSSQ) U2.D2(VSSQ) U2.D8(VSSQ) U2.E3(VSS) U2.E7(VSSQ) U2.F2(VSSQ) U2.F8(VSSQ) U2.H2(VSSQ) U2.H8(VSSQ) U2.J3(VSS) U2.J7(VSSDL) U2.N1(VSS) U2.P9(VSS) ; port GND
CLK_N: R13.2 U2.K8(~{CLK}) ; port DDR_CTRL.CLK_N
CLK_P: R13.1 U2.J8(CLK) ; port DDR_CTRL.CLK_P
DDR_CASN: U2.L7(~{CAS}) ; port DDR_CTRL.DDR_CASN
DDR_CSN: U2.L8(~{CS}) ; port DDR_CTRL.DDR_CSN
DDR_MBA0: U2.L2(BA0) ; port DDR_CTRL.DDR_MBA0
DDR_MBA1: U2.L3(BA1) ; port DDR_CTRL.DDR_MBA1
DDR_MBA2: U2.L1(BA2) ; port DDR_CTRL.DDR_MBA2
DDR_MCKE: U2.K2(CKE) ; port DDR_CTRL.DDR_MCKE
DDR_MDQM0: U2.F3(LDM) ; port DDR_CTRL.DDR_MDQM0
DDR_MDQM1: U2.B3(UDM) ; port DDR_CTRL.DDR_MDQM1
DDR_MDQS0: U2.F7(LDQS) ; port DDR_CTRL.DDR_MDQS0
DDR_MDQS1: U2.B7(UDQS) ; port DDR_CTRL.DDR_MDQS1
DDR_MODT: R14.2 R15.1 U2.K9(ODT) ; port DDR_CTRL.DDR_MODT
DDR_RASN: U2.K7(~{RAS}) ; port DDR_CTRL.DDR_RASN
DDR_WEN: U2.K3(~{WE}) ; port DDR_CTRL.DDR_WEN
MADDR0: U2.M8(PA0) ; port DDR_ADDR.MADDR0
MADDR1: U2.M3(PA1) ; port DDR_ADDR.MADDR1
MADDR2: U2.M7(PA2) ; port DDR_ADDR.MADDR2
MADDR3: U2.N2(PA3) ; port DDR_ADDR.MADDR3
MADDR4: U2.N8(PA4) ; port DDR_ADDR.MADDR4
MADDR5: U2.N3(PA5) ; port DDR_ADDR.MADDR5
MADDR6: U2.N7(PA6) ; port DDR_ADDR.MADDR6
MADDR7: U2.P2(PA7) ; port DDR_ADDR.MADDR7
MADDR8: U2.P8(PA8) ; port DDR_ADDR.MADDR8
MADDR9: U2.P3(PA9) ; port DDR_ADDR.MADDR9
MADDR10: U2.M2(PA10) ; port DDR_ADDR.MADDR10
MADDR11: U2.P7(PA11) ; port DDR_ADDR.MADDR11
MADDR12: U2.R2(PA12) ; port DDR_ADDR.MADDR12
MADDR13: U2.R8(PA13) ; port DDR_ADDR.MADDR13
MDATA0: U2.G8(DQ0) ; port DDR_DATA.MDATA0
MDATA1: U2.G2(DQ1) ; port DDR_DATA.MDATA1
MDATA2: U2.H7(DQ2) ; port DDR_DATA.MDATA2
MDATA3: U2.H3(DQ3) ; port DDR_DATA.MDATA3
MDATA4: U2.H1(DQ4) ; port DDR_DATA.MDATA4
MDATA5: U2.H9(DQ5) ; port DDR_DATA.MDATA5
MDATA6: U2.F1(DQ6) ; port DDR_DATA.MDATA6
MDATA7: U2.F9(DQ7) ; port DDR_DATA.MDATA7
MDATA8: U2.C8(DQ8) ; port DDR_DATA.MDATA8
MDATA9: U2.C2(DQ9) ; port DDR_DATA.MDATA9
MDATA10: U2.D7(DQ10) ; port DDR_DATA.MDATA10
MDATA11: U2.D3(DQ11) ; port DDR_DATA.MDATA11
MDATA12: U2.D1(DQ12) ; port DDR_DATA.MDATA12
MDATA13: U2.D9(DQ13) ; port DDR_DATA.MDATA13
MDATA14: U2.B1(DQ14) ; port DDR_DATA.MDATA14
MDATA15: U2.B9(DQ15) ; port DDR_DATA.MDATA15

Not connected (* = marked no-connect by the designer): U2 A2(NC)* A8(~{UDQS})* E2(NC)* E8(~{LDQS})* R3(NC)* R7(NC)*

### Layout directives
differential pair: CLK_N, CLK_P

### Notes on the sheet
- 100ohm ±10%
- 50ohm ±10%

### Library data of the parts
C58-C63 = CAP: 无极性电容
TC9 = TCAP: 钽电容

## Sheet Part22_ETH_WAN.SchDoc
size A4
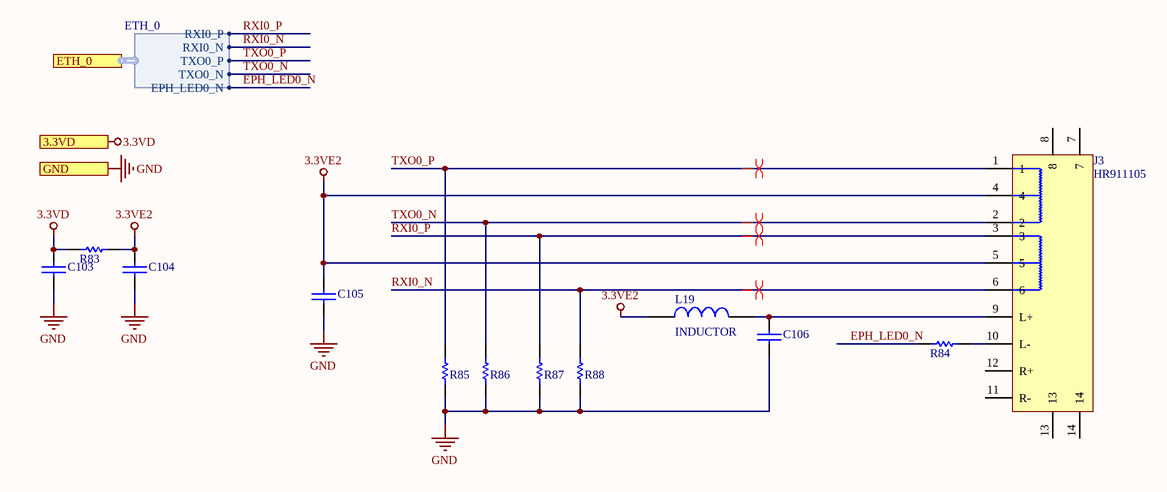
[diagram p9: Part22_ETH_WAN.SchDoc]

### Parts
C103  100nF  [0402C]  (value not drawn)
C104  100nF  [0402C]  (value not drawn)
C105  100nF  [0402C]  (value not drawn)
C106  100nF  [0402C]  (value not drawn)
J3  HR911105  [HR911105A]
L19  INDUCTOR  [0402L]
R83  0R  [0402R]  (value not drawn)
R84  1K  [0402R]  (value not drawn)
R85  49.9R  [0402R]  (value not drawn)
R86  49.9R  [0402R]  (value not drawn)
R87  49.9R  [0402R]  (value not drawn)
R88  49.9R  [0402R]  (value not drawn)

### Ports
3.3VD, ETH_0 (harness ETH_0), GND

### Harnesses
ETH_0: RXI0_P, RXI0_N, TXO0_P, TXO0_N, EPH_LED0_N

### Nets
3.3VD: C103.1 R83.1 ; port 3.3VD
3.3VE2: C104.1 C105.1 J3.4 J3.5 L19.1 R83.2
GND: C103.2 C104.2 C105.2 C106.2 R85.1 R86.1 R87.1 R88.1 ; port GND
EPH_LED0_N: R84.2 ; port ETH_0.EPH_LED0_N
RXI0_N: J3.6 R88.2 ; port ETH_0.RXI0_N
RXI0_P: J3.3 R87.2 ; port ETH_0.RXI0_P
TXO0_N: J3.2 R86.2 ; port ETH_0.TXO0_N
TXO0_P: J3.1 R85.2 ; port ETH_0.TXO0_P
NetC106_1: C106.1 J3.9(L+) L19.2
NetJ3_10: J3.10(L-) R84.1

Not connected (* = marked no-connect by the designer): J3 7 8 11(R-) 12(R+) 13 14

### Layout directives
differential pair: RXI0_N, RXI0_P, TXO0_N, TXO0_P

### Library data of the parts
C103-C106 = CAP: 无极性电容
R83-R88 = RES

## Sheet Part07_NorFlash.SchDoc
size A4
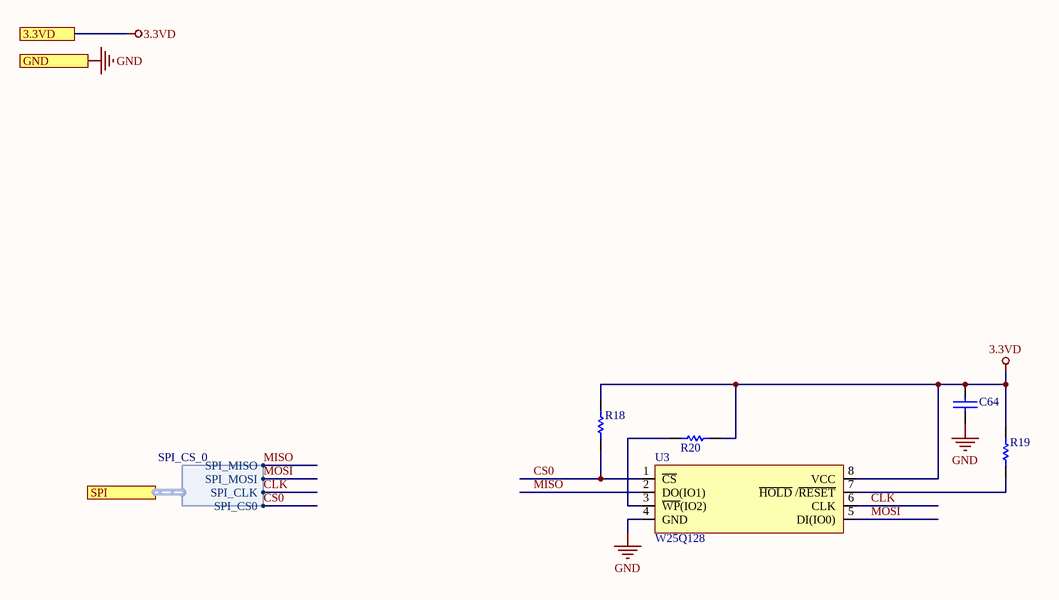
[diagram p10: Part07_NorFlash.SchDoc]

### Parts
C64  0.1uF/16V  [0402C]  (value not drawn)
R18  RES  [0402R]  (value not drawn)
R19  RES  [0402R]  (value not drawn)
R20  RES  [0402R]  (value not drawn)
U3  W25Q128  [SOP8]

### Ports
3.3VD, GND, SPI (harness SPI_CS_0)

### Harnesses
SPI_CS_0: SPI_MISO, SPI_MOSI, SPI_CLK, SPI_CS0

### Nets
3.3VD: C64.1 R18.1 R19.1 R20.2 U3.8(VCC) ; port 3.3VD
GND: C64.2 U3.4(GND) ; port GND
CLK: U3.6(CLK) ; port SPI.SPI_CLK
CS0: R18.2 U3.1(~{CS}) ; port SPI.SPI_CS0
MISO: U3.2(DO(IO1)) ; port SPI.SPI_MISO
MOSI: U3.5(DI(IO0)) ; port SPI.SPI_MOSI
NetR19_2: R19.2 U3.7(~{HOLD}_/~{RESET})
NetR20_1: R20.1 U3.3(~{WP}(IO2))

### Library data of the parts
C64 = CAP: 无极性电容

## Sheet Part25_Button_LED.SchDoc
size A4
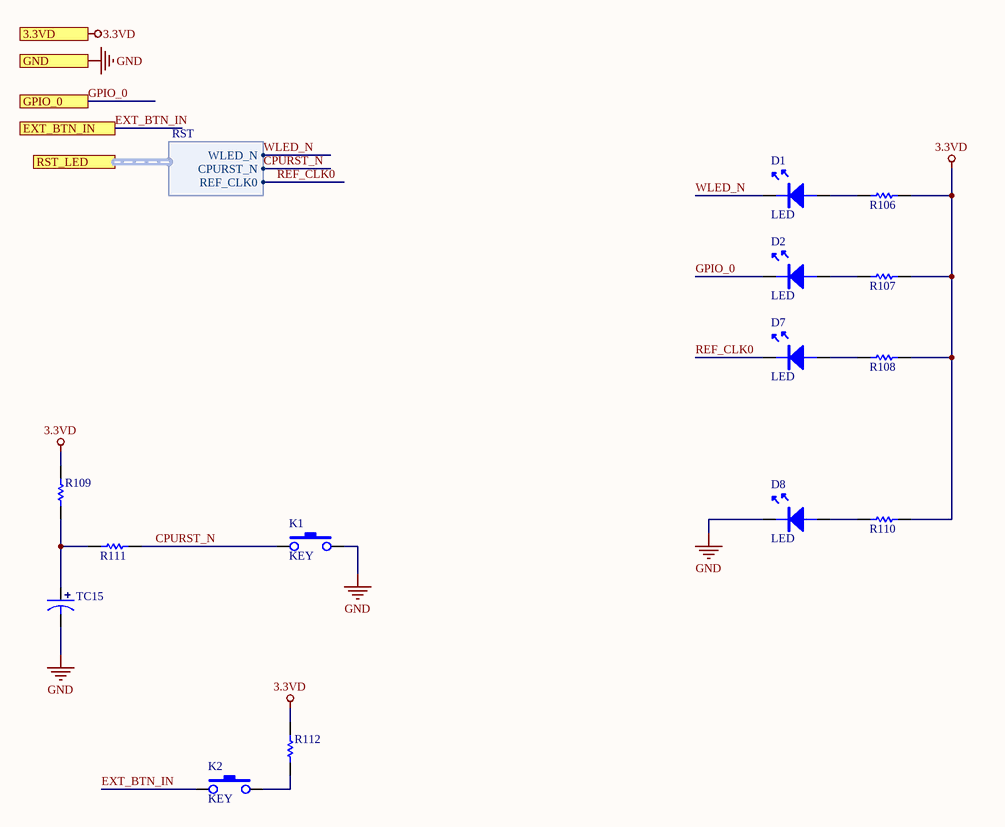
[diagram p11: Part25_Button_LED.SchDoc]

### Parts
D1  LED  [LED-0603B]
D2  LED  [LED-0603B]
D7  LED  [LED-0603B]
D8  LED  [LED-0603B]
K1  KEY  [SMD-6X6X4.3]
K2  KEY  [SMD-6X6X4.3]
R106  RES  [0402R]  (value not drawn)
R107  RES  [0402R]  (value not drawn)
R108  RES  [0402R]  (value not drawn)
R109  RES  [0402R]  (value not drawn)
R110  RES  [0402R]  (value not drawn)
R111  RES  [0402R]  (value not drawn)
R112  RES  [0402R]  (value not drawn)
TC15  4.7uF/6.3V  [TAJ-A/3216]  (value not drawn)

### Ports
3.3VD, EXT_BTN_IN, GND, GPIO_0, RST_LED (harness RST)

### Harnesses
RST: WLED_N, CPURST_N, REF_CLK0

### Nets
3.3VD: R106.2 R107.2 R108.2 R109.1 R110.2 R112.1 ; port 3.3VD
GND: D8.K K1.3 TC15.2 ; port GND
CPURST_N: K1.1 R111.2 ; port RST_LED.CPURST_N
EXT_BTN_IN: K2.1 ; port EXT_BTN_IN
GPIO_0: D2.K ; port GPIO_0  [project net EXT_INT]
REF_CLK0: D7.K ; port RST_LED.REF_CLK0
WLED_N: D1.K ; port RST_LED.WLED_N
NetD1_A: D1.A R106.1
NetD2_A: D2.A R107.1
NetD7_A: D7.A R108.1
NetD8_A: D8.A R110.1
NetK2_3: K2.3 R112.2
NetR109_2: R109.2 R111.1 TC15.1

### Library data of the parts
TC15 = TCAP: 钽电容

## Sheet Part23_ETH_LAN.SchDoc
size A4
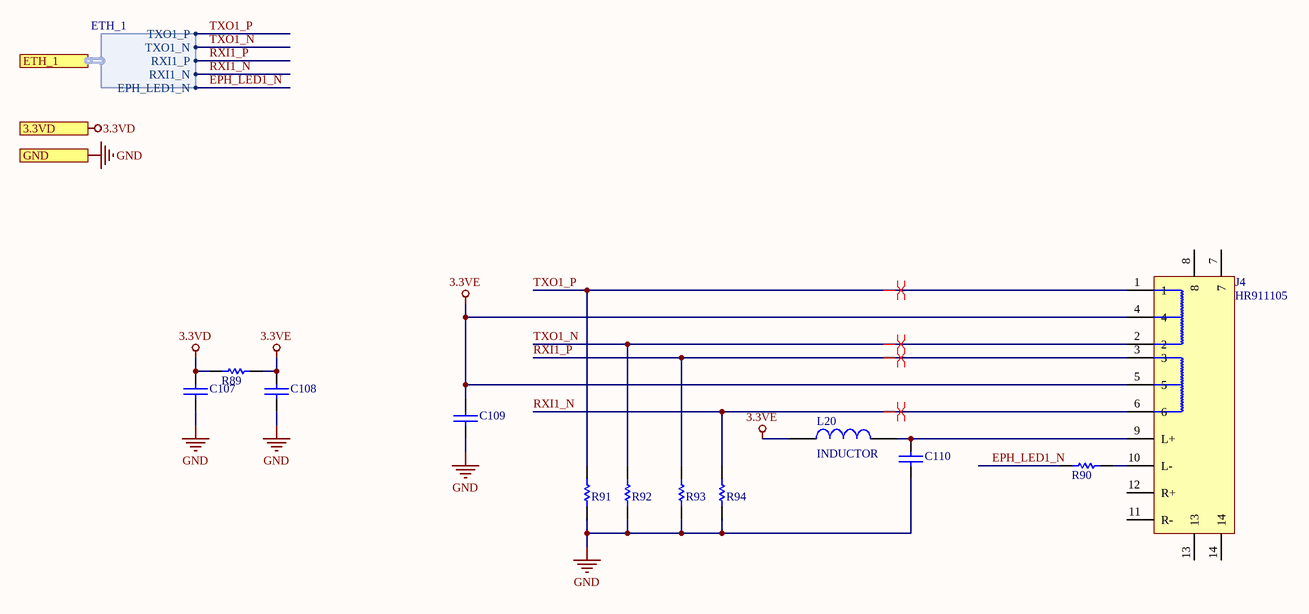
[diagram p12: Part23_ETH_LAN.SchDoc]

### Parts
C107  100nF  [0402C]  (value not drawn)
C108  100nF  [0402C]  (value not drawn)
C109  100nF  [0402C]  (value not drawn)
C110  100nF  [0402C]  (value not drawn)
J4  HR911105  [HR911105A]
L20  INDUCTOR  [0402L]
R89  0R  [0402R]  (value not drawn)
R90  1K  [0402R]  (value not drawn)
R91  49.9R  [0402R]  (value not drawn)
R92  49.9R  [0402R]  (value not drawn)
R93  49.9R  [0402R]  (value not drawn)
R94  49.9R  [0402R]  (value not drawn)

### Ports
3.3VD, ETH_1 (harness ETH_1), GND

### Harnesses
ETH_1: TXO1_P, TXO1_N, RXI1_P, RXI1_N, EPH_LED1_N

### Nets
3.3VD: C107.1 R89.1 ; port 3.3VD
3.3VE: C108.1 C109.1 J4.4 J4.5 L20.1 R89.2
GND: C107.2 C108.2 C109.2 C110.2 R91.1 R92.1 R93.1 R94.1 ; port GND
EPH_LED1_N: R90.2 ; port ETH_1.EPH_LED1_N
RXI1_N: J4.6 R94.2 ; port ETH_1.RXI1_N
RXI1_P: J4.3 R93.2 ; port ETH_1.RXI1_P
TXO1_N: J4.2 R92.2 ; port ETH_1.TXO1_N
TXO1_P: J4.1 R91.2 ; port ETH_1.TXO1_P
NetC110_1: C110.1 J4.9(L+) L20.2
NetJ4_10: J4.10(L-) R90.1

Not connected (* = marked no-connect by the designer): J4 7 8 11(R-) 12(R+) 13 14

### Layout directives
differential pair: RXI1_N, RXI1_P, TXO1_N, TXO1_P

### Library data of the parts
C107-C110 = CAP: 无极性电容
R89-R94 = RES

## Sheet Part06_DIP.SchDoc
size A4
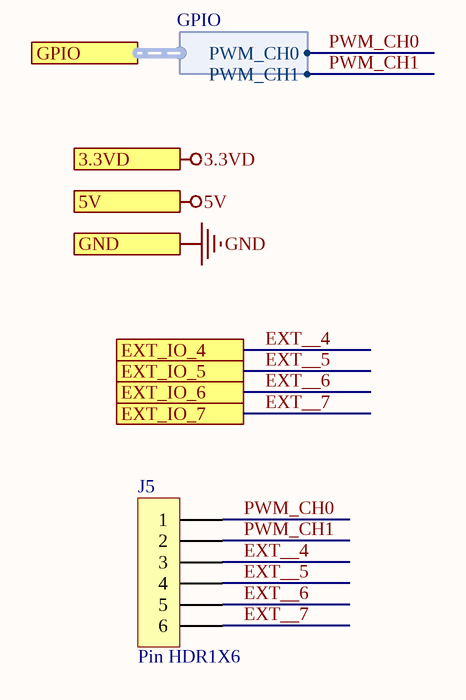
[diagram p13: Part06_DIP.SchDoc]

### Parts
J5  Pin HDR1X6  [Pin HDR1X6/2.54mm-S]

### Ports
3.3VD, 5V, EXT_IO_4, EXT_IO_5, EXT_IO_6, EXT_IO_7, GND, GPIO (harness GPIO)

### Harnesses
GPIO: PWM_CH0, PWM_CH1

### Nets
EXT__4: J5.3 ; port EXT_IO_4
EXT__5: J5.4 ; port EXT_IO_5
EXT__6: J5.5 ; port EXT_IO_6
EXT__7: J5.6 ; port EXT_IO_7
PWM_CH0: J5.1 ; port GPIO.PWM_CH0
PWM_CH1: J5.2 ; port GPIO.PWM_CH1

## Sheet Part11_I2S_WM8960.SchDoc
size A4
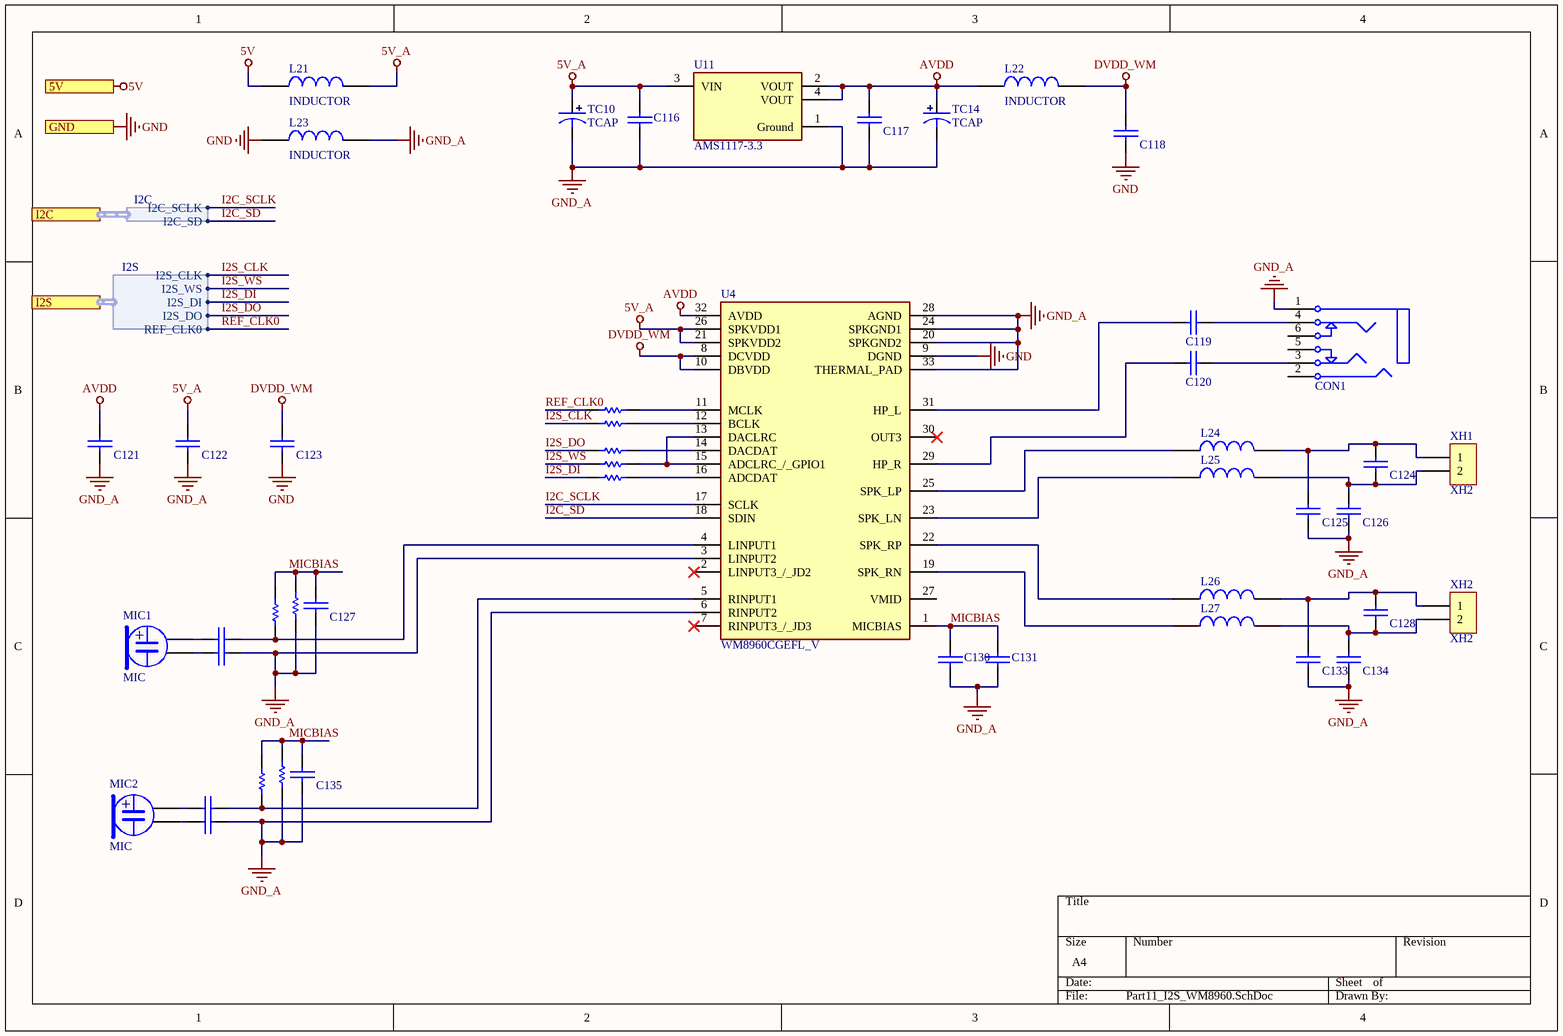
[diagram p14: Part11_I2S_WM8960.SchDoc]

### Parts
C116  100nF  [0603C]  (value not drawn)
C117  100nF  [0603C]  (value not drawn)
C118  100nF  [0402C]  (value not drawn)
C119  100nF  [1206C]  (value not drawn)
C120  100nF  [1206C]  (value not drawn)
C121  100nF  [0603C]  (value not drawn)
C122  100nF  [0603C]  (value not drawn)
C123  100nF  [0603C]  (value not drawn)
C124  100nF  [1206C]  (value not drawn)
C125  100nF  [1206C]  (value not drawn)
C126  100nF  [1206C]  (value not drawn)
C127  100nF  [0603C]  (value not drawn)
C128  100nF  [1206C]  (value not drawn)
C129  100nF  [0603C]  (value not drawn)
C130  100nF  [0402C]  (value not drawn)
C131  100nF  [0402C]  (value not drawn)
C132  100nF  [0603C]  (value not drawn)
C133  100nF  [1206C]  (value not drawn)
C134  100nF  [1206C]  (value not drawn)
C135  100nF  [0603C]  (value not drawn)
C136  100nF  [0603C]  (value not drawn)
C137  100nF  [0603C]  (value not drawn)
CON1  PJ342  [PJ342A]  (value not drawn)
L21  INDUCTOR  [0805L]
L22  INDUCTOR  [0805L]
L23  INDUCTOR  [0805L]
L24  INDUCTOR  [0805L]  (value not drawn)
L25  INDUCTOR  [0805L]  (value not drawn)
L26  INDUCTOR  [0805L]  (value not drawn)
L27  INDUCTOR  [0805L]  (value not drawn)
MIC1  MIC  [MIC-4.5X1.9]
MIC2  MIC  [MIC-4.5X1.9]
R21  0R  [0402R]  (value not drawn)
R22  0R  [0402R]  (value not drawn)
R23  0R  [0402R]  (value not drawn)
R24  0R  [0402R]  (value not drawn)
R101  0R  [0402R]  (value not drawn)
R102  0R  [0402R]  (value not drawn)
R103  0R  [0402R]  (value not drawn)
R104  0R  [0402R]  (value not drawn)
R105  0R  [0402R]  (value not drawn)
TC10  TCAP  [TAJ-A/3216]
TC14  TCAP  [TAJ-A/3216]
U4  WM8960CGEFL_V  [QFN50P500X500X100-33N]
U11  AMS1117-3.3  [FP-AMS1117-IPC_C]
XH1  XH2  [XH2/2.54mm/180]
XH2  XH2  [XH2/2.54mm/180]

### Ports
5V, GND, I2C (harness I2C), I2S (harness I2S)

### Harnesses
I2S: I2S_CLK, I2S_WS, I2S_DI, I2S_DO, REF_CLK0
I2C: I2C_SCLK, I2C_SD

### Nets
5V: L21.1 ; port 5V
5V_A: C116.1 C122.2 L21.2 TC10.1 U4.21(SPKVDD2) U4.26(SPKVDD1) U11.3(VIN)
AVDD: C117.1 C121.2 L22.1 TC14.1 U4.32(AVDD) U11.2(VOUT) U11.4(VOUT)
DVDD_WM: C118.1 C123.1 L22.2 U4.8(DCVDD) U4.10(DBVDD)
GND: C118.2 C123.2 L23.1 U4.9(DGND) ; port GND
GND_A: C116.2 C117.2 C121.1 C122.1 C125.1 C126.1 C127.2 C130.2 C131.2 C132.1 C133.1 C134.1 C135.2 C137.1 CON1.1 L23.2 R102.1 R104.1 TC10.2 TC14.2 U4.3(LINPUT2) U4.6(RINPUT2) U4.20(SPKGND2) U4.24(SPKGND1) U4.28(AGND) U4.33(THERMAL_PAD) U11.1(Ground)
I2C_SCLK: U4.17(SCLK) ; port I2C.I2C_SCLK
I2C_SD: U4.18(SDIN) ; port I2C.I2C_SD
I2S_CLK: R22.1 ; port I2S.I2S_CLK
I2S_DI: R101.1 ; port I2S.I2S_DI
I2S_DO: R23.1 ; port I2S.I2S_DO
I2S_WS: R24.1 ; port I2S.I2S_WS
MICBIAS: C127.1 C130.1 C131.1 C135.1 R102.2 R103.2 R104.2 R105.2 U4.1(MICBIAS)
REF_CLK0: R21.1 ; port I2S.REF_CLK0
NetC119_1: C119.1 CON1.4
NetC119_2: C119.2 U4.31(HP_L)
NetC120_1: C120.1 CON1.3
NetC120_2: C120.2 U4.29(HP_R)
NetC124_1: C124.1 C126.2 L25.2 XH1.2
NetC124_2: C124.2 C125.2 L24.2 XH1.1
NetC128_1: C128.1 C134.2 L27.2 XH2.2
NetC128_2: C128.2 C133.2 L26.2 XH2.1
NetC129_1: C129.1 R103.1 U4.4(LINPUT1)
NetC129_2: C129.2 MIC1.1
NetC132_2: C132.2 MIC1.2
NetC136_1: C136.1 R105.1 U4.5(RINPUT1)
NetC136_2: C136.2 MIC2.1
NetC137_2: C137.2 MIC2.2
NetL24_1: L24.1 U4.25(SPK_LP)
NetL25_1: L25.1 U4.23(SPK_LN)
NetL26_1: L26.1 U4.22(SPK_RP)
NetL27_1: L27.1 U4.19(SPK_RN)
NetR21_2: R21.2 U4.11(MCLK)
NetR22_2: R22.2 U4.12(BCLK)
NetR23_2: R23.2 U4.14(DACDAT)
NetR24_2: R24.2 U4.13(DACLRC) U4.15(ADCLRC_/_GPIO1)
NetR101_2: R101.2 U4.16(ADCDAT)

Not connected (* = marked no-connect by the designer): CON1 2 5 6; U4 2(LINPUT3_/_JD2)* 7(RINPUT3_/_JD3)* 27(VMID) 30(OUT3)*

### Notes on the sheet
- (in symbol MIC) +

### Library data of the parts
C116-C137 = CAP: 无极性电容
CON1 = PJ342: 3.5耳机插座,4Pin; BOM名称: 耳机插座; 版权归属: 源创客; 学习资源: www.ooocke.com
MIC1 MIC2 = MIC: 电容麦克风
R21-R24 R101-R105 = RES
TC10 TC14 = TCAP: 钽电容
U4 = WM8960CGEFL_V: Undefined or Miscellaneous; Manufacturer_Name: WOLFSON MICROELECTRONICS; Manufacturer_Part_Number: WM8960CGEFL/V; Datasheet Link: https://componentsearchengine.com/Datasheets/2/WM8960CGEFL_V.pdf; Height: 1mm; Arrow Part Number: WM8960CGEFL/V
U11 = CMP-209535-000001-1: LDO Voltage Regulators 1A, 3.3V; Manufacturer: Advanced Monolithic Systems; Dropout Voltage: 1.1V; Output Type: Fixed; Nominal Supply Current: 5mA; Max Power Dissipation: 1.2W; Max Supply Voltage: 15V; Number Of Outputs: 1; Standoff Height: 0.64mm; Max Junction Temp: +125°C; Height: 1.8mm; Package: AMS1117; Device Class L2: Power Management ICs; ComponentLink2Description: Datasheet; ComponentLink2URL: http://www.advanced-monolithic.com/pdf/ds1117.pdf; Category: IC; RoHS: TRUE; Automotive: No; Device Class L1: Integrated Circuits (ICs); Output Current: 1A; Device Class L3: Voltage Regulators - Linear; Temperature: -40°C to +125°C; Output Voltage: 3.3V; Manufacturer Part Number: AMS1117-3.3; Temperature Range Low: -40°C; Octopart: https://octopart.com/ams1117-3.3-advanced+monolithic+systems-25899300; Lead Free: Yes; Ipc Land Pattern Name: SOT229P700X180-4; Temperature Range High: +125°C

## Sheet Part14_SPI_ST7789.SchDoc
size A4
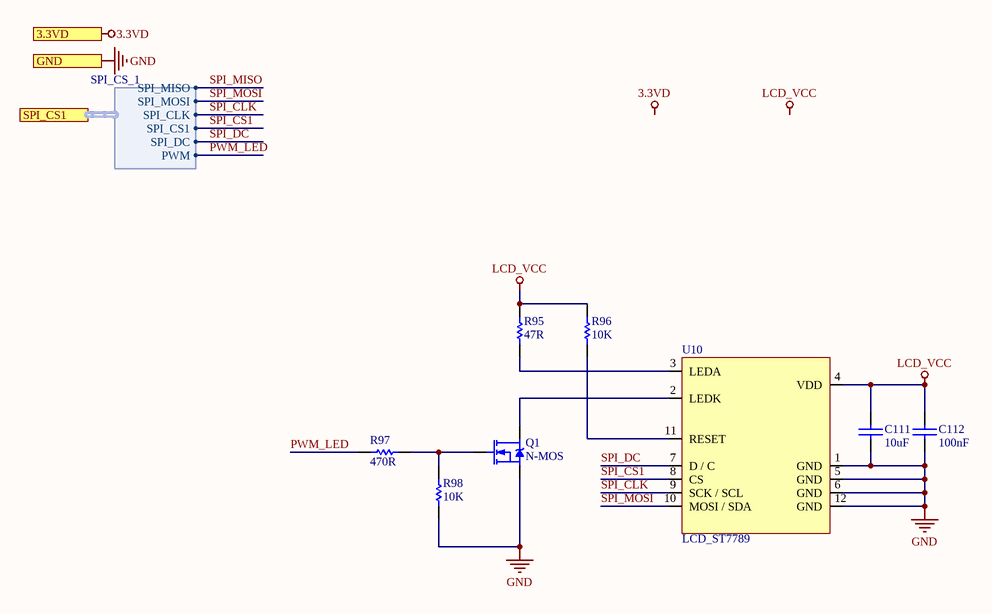
[diagram p15: Part14_SPI_ST7789.SchDoc]

### Parts
C111  10uF  [0603C]
C112  100nF  [0603C]
Q1  N-MOS  [SOT23]
R95  47R  [0603R]
R96  10K  [0603R]
R97  470R  [0603R]
R98  10K  [0603R]
U10  LCD_ST7789  [ST7789_1.3inch_IPS_TFT]

### Ports
3.3VD, GND, SPI_CS1 (harness SPI_CS_1)

### Harnesses
SPI_CS_1: SPI_MISO, SPI_MOSI, SPI_CLK, SPI_CS1, SPI_DC, PWM

### Nets
GND: C111.1 C112.1 Q1.S R98.1 U10.1(GND) U10.5(GND) U10.6(GND) U10.12(GND) ; port GND
LCD_VCC: C111.2 C112.2 R95.2 R96.2 U10.4(VDD)
PWM_LED: R97.1 ; port SPI_CS1.PWM  [project net PWM_CH0]
SPI_CLK: U10.9(SCK_/_SCL) ; port SPI_CS1.SPI_CLK  [project net CLK]
SPI_CS1: U10.8(CS) ; port SPI_CS1.SPI_CS1
SPI_DC: U10.7(D_/_C) ; port SPI_CS1.SPI_DC  [project net EXT_INT]
SPI_MOSI: U10.10(MOSI_/_SDA) ; port SPI_CS1.SPI_MOSI  [project net MOSI]
NetQ1_D: Q1.D U10.2(LEDK)
NetQ1_G: Q1.G R97.2 R98.2
NetR95_1: R95.1 U10.3(LEDA)
NetR96_1: R96.1 U10.11(RESET)

### Notes on the sheet
- Labels drawn without touching a wire or pin: 3.3VD, LCD_VCC

### Library data of the parts
C111 C112 = CAP: 无极性电容
Q1 = N-MOS: N沟道场效应管
R95-R98 = RES

## Sheet Part20_UART_BLE.SchDoc
size A4
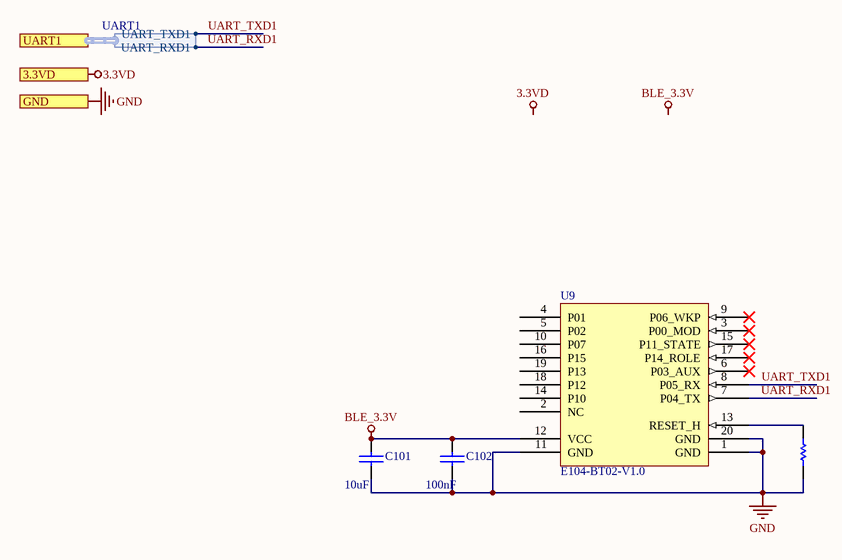
[diagram p16: Part20_UART_BLE.SchDoc]

### Parts
C101  10uF  [0603C]
C102  100nF  [0603C]
R82  470R  [0402R]  (value not drawn)
U9  E104-BT02-V1.0  [PE104-BT02]

### Ports
3.3VD, GND, UART1 (harness UART1)

### Harnesses
UART1: UART_TXD1, UART_RXD1

### Nets
BLE_3.3V: C101.2 C102.2 U9.12(VCC)
GND: C101.1 C102.1 R82.1 U9.1(GND) U9.11(GND) U9.20(GND) ; port GND
UART_RXD1: U9.7(P04_TX) ; port UART1.UART_RXD1
UART_TXD1: U9.8(P05_RX) ; port UART1.UART_TXD1
NetR82_2: R82.2 U9.13(RESET_H)

Not connected (* = marked no-connect by the designer): U9 2(NC) 3(P00_MOD)* 4(P01) 5(P02) 6(P03_AUX)* 9(P06_WKP)* 10(P07) 14(P10) 15(P11_STATE)* 16(P15) 17(P14_ROLE)* 18(P12) 19(P13)

### Notes on the sheet
- Labels drawn without touching a wire or pin: 3.3VD, BLE_3.3V

### Library data of the parts
C101 C102 = CAP: 无极性电容
R82 = RES

## Sheet Part10_SD_card.SchDoc
size A4
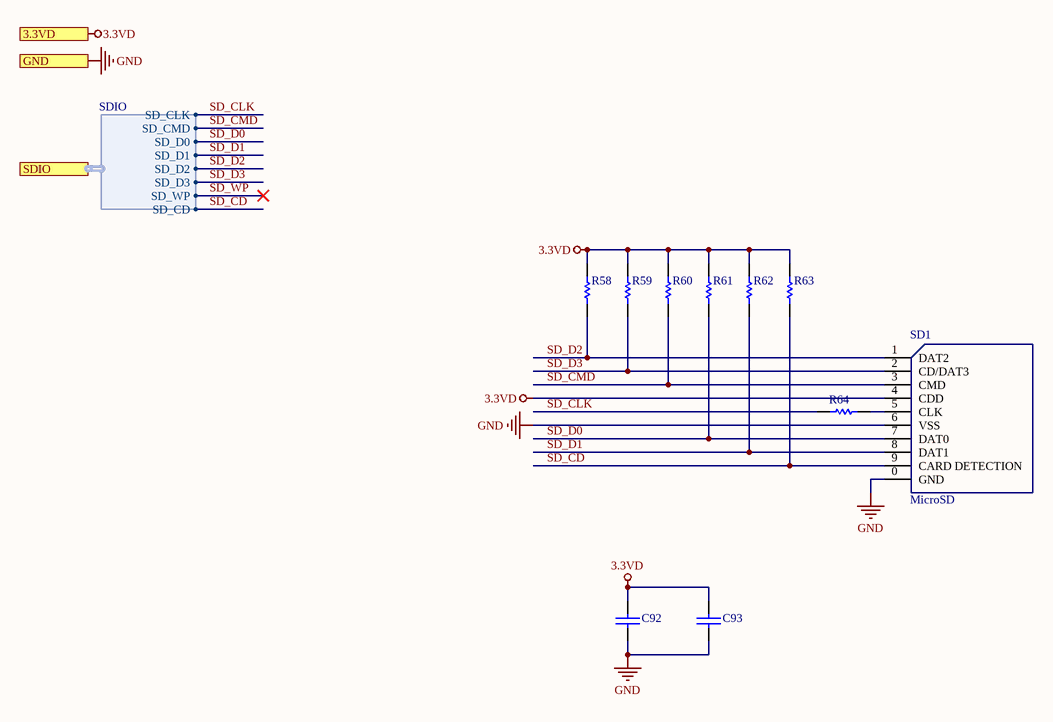
[diagram p17: Part10_SD_card.SchDoc]

### Parts
C92  10uF  [0402C]  (value not drawn)
C93  100nF  [0402C]  (value not drawn)
R58  10K  [0402R]  (value not drawn)
R59  10K  [0402R]  (value not drawn)
R60  10K  [0402R]  (value not drawn)
R61  10K  [0402R]  (value not drawn)
R62  10K  [0402R]  (value not drawn)
R63  10K  [0402R]  (value not drawn)
R64  22R  [0402R]  (value not drawn)
SD1  MicroSD  [Micro SD]

### Ports
3.3VD, GND, SDIO (harness SDIO)

### Harnesses
SDIO: SD_CLK, SD_CMD, SD_D0, SD_D1, SD_D2, SD_D3, SD_WP, SD_CD

### Nets
3.3VD: C92.1 C93.1 R58.1 R59.1 R60.1 R61.1 R62.1 R63.1 SD1.4(CDD) ; port 3.3VD
GND: C92.2 C93.2 SD1.0(GND) SD1.6(VSS) ; port GND
SD_CD: R63.2 SD1.9(CARD_DETECTION) ; port SDIO.SD_CD
SD_CLK: R64.1 ; port SDIO.SD_CLK
SD_CMD: R60.2 SD1.3(CMD) ; port SDIO.SD_CMD
SD_D0: R61.2 SD1.7(DAT0) ; port SDIO.SD_D0
SD_D1: R62.2 SD1.8(DAT1) ; port SDIO.SD_D1
SD_D2: R58.2 SD1.1(DAT2) ; port SDIO.SD_D2
SD_D3: R59.2 SD1.2(CD/DAT3) ; port SDIO.SD_D3
NetR64_2: R64.2 SD1.5(CLK)

### Library data of the parts
C92 C93 = CAP: 无极性电容
R58-R64 = RES

## Sheet Part12_USB_HUB.SchDoc
size A4
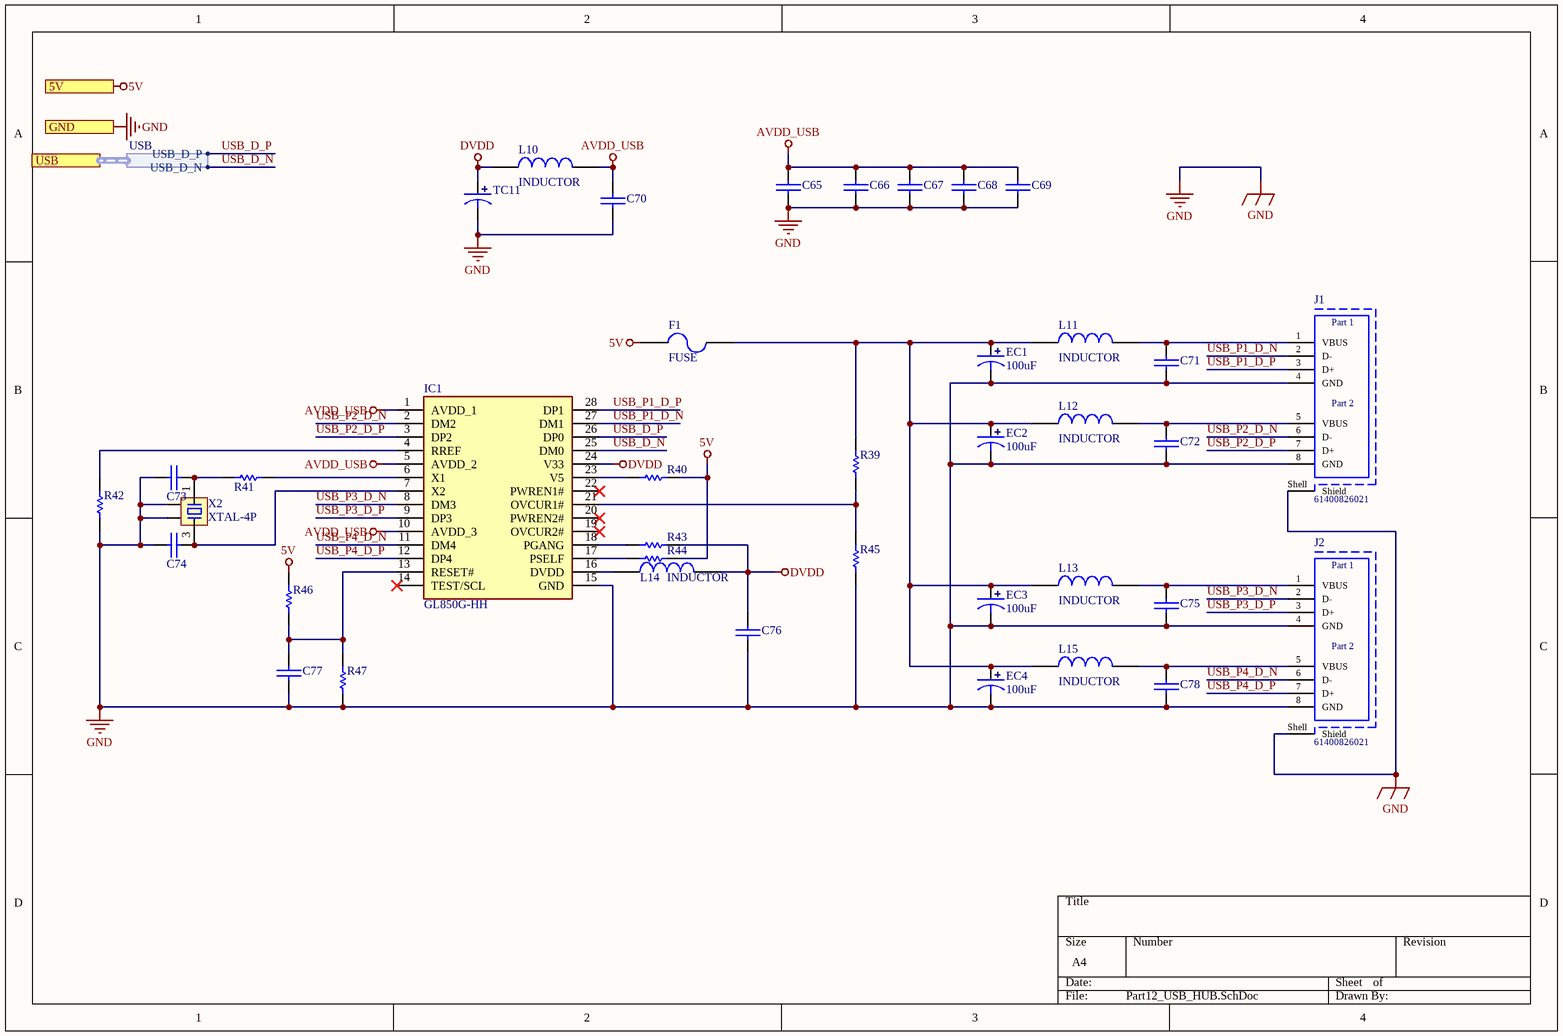
[diagram p18: Part12_USB_HUB.SchDoc]

### Parts
C65  100nF/16V  [0402C]  (value not drawn)
C66  100nF/16V  [0402C]  (value not drawn)
C67  1uF/16V  [0402C]  (value not drawn)
C68  1uF/16V  [0402C]  (value not drawn)
C69  100nF/16V  [0402C]  (value not drawn)
C70  100nF/16V  [0402C]  (value not drawn)
C71  100nF/16V  [0603C]  (value not drawn)
C72  100nF/16V  [0603C]  (value not drawn)
C73  20pF  [0402C]  (value not drawn)
C74  20pF  [0402C]  (value not drawn)
C75  100nF/16V  [0603C]  (value not drawn)
C76  100nF/16V  [0402C]  (value not drawn)
C77  1uF/16V  [0402C]  (value not drawn)
C78  100nF/16V  [0603C]  (value not drawn)
EC1  100uF  [SMD-EC4.0X4.3X5.4]
EC2  100uF  [SMD-EC4.0X4.3X5.4]
EC3  100uF  [SMD-EC4.0X4.3X5.4]
EC4  100uF  [SMD-EC4.0X4.3X5.4]
F1  FUSE  [FUSE-1210]
IC1  GL850G-HH  [SOP65P780X200-28N]
J1  61400826021  [61400826021]
J2  61400826021  [61400826021]
L10  INDUCTOR  [0603L]
L11  INDUCTOR  [0603L]
L12  INDUCTOR  [0603L]
L13  INDUCTOR  [0603L]
L14  INDUCTOR  [0603L]
L15  INDUCTOR  [0603L]
R39  30K  [0402R]  (value not drawn)
R40  0R  [0402R]  (value not drawn)
R41  0R  [0402R]  (value not drawn)
R42  680R / 1%  [0402R]  (value not drawn)
R43  100K  [0402R]  (value not drawn)
R44  10K  [0402R]  (value not drawn)
R45  30K  [0402R]  (value not drawn)
R46  10K  [0402R]  (value not drawn)
R47  47K  [0402R]  (value not drawn)
TC11  4.7uF/6.3V  [TAJ-A/3216]  (value not drawn)
X2  XTAL-4P  [OSC 3225-4P]

### Ports
5V, GND, USB (harness USB)

### Harnesses
USB: USB_D_P, USB_D_N

### Nets
5V: F1.1 R40.2 R44.2 R46.1 ; port 5V
AVDD_USB: C65.1 C66.1 C67.1 C68.1 C69.1 C70.1 IC1.1(AVDD_1) IC1.5(AVDD_2) IC1.10(AVDD_3) L10.2
DVDD: C76.1 IC1.24(V33) L10.1 L14.2 R43.2 TC11.1
GND: C65.2 C66.2 C67.2 C68.2 C69.2 C70.2 C71.2 C72.2 C73.1 C74.1 C75.2 C76.2 C77.2 C78.2 EC1.2 EC2.2 EC3.2 EC4.2 IC1.15(GND) J1.4(GND) J1.8(GND) J1.Shell(Shield) J2.4(GND) J2.8(GND) J2.Shell(Shield) R42.2 R45.2 R47.2 TC11.2 X2.2 X2.4 ; port GND
USB_D_N: IC1.25(DM0) ; port USB.USB_D_N
USB_D_P: IC1.26(DP0) ; port USB.USB_D_P
USB_P1_D_N: IC1.27(DM1) J1.2(D-)
USB_P1_D_P: IC1.28(DP1) J1.3(D+)
USB_P2_D_N: IC1.2(DM2) J1.6(D-)
USB_P2_D_P: IC1.3(DP2) J1.7(D+)
USB_P3_D_N: IC1.8(DM3) J2.2(D-)
USB_P3_D_P: IC1.9(DP3) J2.3(D+)
USB_P4_D_N: IC1.11(DM4) J2.6(D-)
USB_P4_D_P: IC1.12(DP4) J2.7(D+)
NetC71_1: C71.1 J1.1(VBUS) L11.2
NetC72_1: C72.1 J1.5(VBUS) L12.2
NetC73_2: C73.2 R41.1 X2.1
NetC74_2: C74.2 IC1.7(X2) X2.3
NetC75_1: C75.1 J2.1(VBUS) L13.2
NetC77_1: C77.1 IC1.13(RESET#) R46.2 R47.1
NetC78_1: C78.1 J2.5(VBUS) L15.2
NetEC1_1: EC1.1 EC2.1 EC3.1 EC4.1 F1.2 L11.1 L12.1 L13.1 L15.1 R39.1
NetIC1_4: IC1.4(RREF) R42.1
NetIC1_6: IC1.6(X1) R41.2
NetIC1_16: IC1.16(DVDD) L14.1
NetIC1_17: IC1.17(PSELF) R44.1
NetIC1_18: IC1.18(PGANG) R43.1
NetIC1_21: IC1.21(OVCUR1#) R39.2 R45.1
NetIC1_23: IC1.23(V5) R40.1

Not connected (* = marked no-connect by the designer): IC1 14(TEST/SCL)* 19(OVCUR2#)* 20(PWREN2#)* 22(PWREN1#)*

### Notes on the sheet
- (in symbol CMP-1502-03229-1) Part 1; Part 2

### Library data of the parts
C65-C78 = CAP: 无极性电容
EC1-EC4 = SMD_ECAP: 贴片电解电容
IC1 = GL850G-HH: Integrated Circuit; Manufacturer_Name: Genesys; Datasheet Link: https://www.kean.com.au/oshw/WR703N/GL850G%20USB%20Hub%201.07.pdf; Height: 2mm; Manufacturer_Part_Number: GL850G-HH; Arrow Part Number: GL850G-HH
J1 J2 = CMP-1502-03229-1: USB 2.0 Type A Receptacle WR-COM, Stacked Horizontal, THT; Manufacturer: Wurth Elektronik; Contact Resistance: 20mOhm; Rated Current: 1.5A; Working Voltage: 30VAC; Connector Type: USB2.0TypeA; Packaging: Tray; Package Reference: 61400826021; Mounting Technology: THT; Datasheet URL: https://katalog.we-online.de/em/datasheet/61400826021.pdf; Operating Temperature: -40to105degC; Gender: Receptacle; Orientation: StackedHorizontal; Part Number: 61400826021; Publisher: WurthElektronik; Manufacturer URL: http://www.we-online.de
R39-R47 = RES
TC11 = TCAP: 钽电容
X2 = XTAL-4P: 4脚无源晶振

## Sheet Part24_PCIE.SchDoc
size A4

## Sheet Part21_UART_ZigBee.SchDoc
size A4
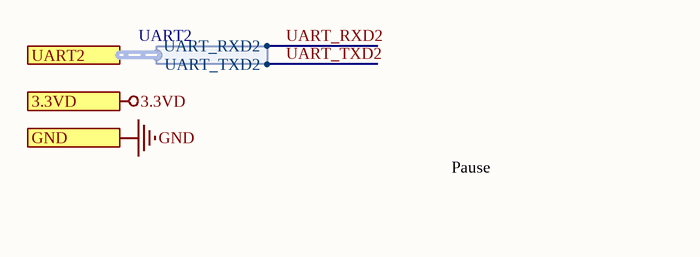
[diagram p19: Part21_UART_ZigBee.SchDoc]

### Ports
3.3VD, GND, UART2 (harness UART2)

### Harnesses
UART2: UART_RXD2, UART_TXD2

### Notes on the sheet
- Pause

## Sheet Part18_I2C_IO_Expander.SchDoc
size A4
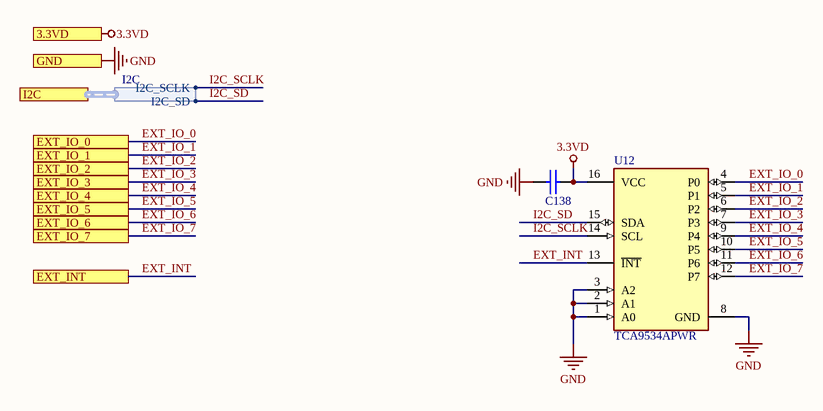
[diagram p20: Part18_I2C_IO_Expander.SchDoc]

### Parts
C138  100nF  [0402C]  (value not drawn)
U12  TCA9534APWR  [FP-PW0016A-MFG]

### Ports
3.3VD, EXT_INT, EXT_IO_0, EXT_IO_1, EXT_IO_2, EXT_IO_3, EXT_IO_4, EXT_IO_5, EXT_IO_6, EXT_IO_7, GND, I2C (harness I2C)

### Harnesses
I2C: I2C_SCLK, I2C_SD

### Nets
3.3VD: C138.2 U12.16(VCC) ; port 3.3VD
GND: C138.1 U12.1(A0) U12.2(A1) U12.3(A2) U12.8(GND) ; port GND
EXT_INT: U12.13(~{INT}) ; port EXT_INT
EXT_IO_0: U12.4(P0) ; port EXT_IO_0
EXT_IO_1: U12.5(P1) ; port EXT_IO_1
EXT_IO_2: U12.6(P2) ; port EXT_IO_2
EXT_IO_3: U12.7(P3) ; port EXT_IO_3  [project net EXT_BTN_IN]
EXT_IO_4: U12.9(P4) ; port EXT_IO_4  [project net EXT__4]
EXT_IO_5: U12.10(P5) ; port EXT_IO_5  [project net EXT__5]
EXT_IO_6: U12.11(P6) ; port EXT_IO_6  [project net EXT__7]
EXT_IO_7: U12.12(P7) ; port EXT_IO_7  [project net EXT__6]
I2C_SCLK: U12.14(SCL) ; port I2C.I2C_SCLK
I2C_SD: U12.15(SDA) ; port I2C.I2C_SD

### Library data of the parts
C138 = CAP: 无极性电容
U12 = CMP-04886-000001-1: IC I/O EXPANDER I2C 8B 16TSSOP; Manufacturer: Texas Instruments; Max Junction Temp: 100°C; Interface: I2C,SMBus; Standoff Height: 0.05mm; Nominal Supply Current: 5-22uA; Number Of I/Os: 8; Max Supply Voltage: 5.5V; Min Supply Voltage: 1.65V; Frequency: 400kHz; Device Class L3: I/O Expanders; Octopart: https://octopart.com/tca9534apwr-texas+instruments-50333529; ComponentLink2URL: http://www.ti.com/lit/ds/symlink/tca9534a.pdf; ComponentLink2Description: Datasheet; Ambient Temperature Range Low: -40°C; Manufacturer Part Number: TCA9534APWR; Lead Free: Yes; Category: IC; Package: PW0016A; Automotive: No; Temperature Range Low: -40°C; Temperature Range High: +85°C; Device Class L2: Interface ICs; Temperature: -40°C to +85°C; RoHS: TRUE; Height: 1.2mm; Digikey Description: IC I/O EXPANDER I2C 8B 16TSSOP; Device Class L1: Integrated Circuits (ICs); Ambient Temperature Range High: +85°C